# Altium project LAB_B3_209_V1.PrjPcb
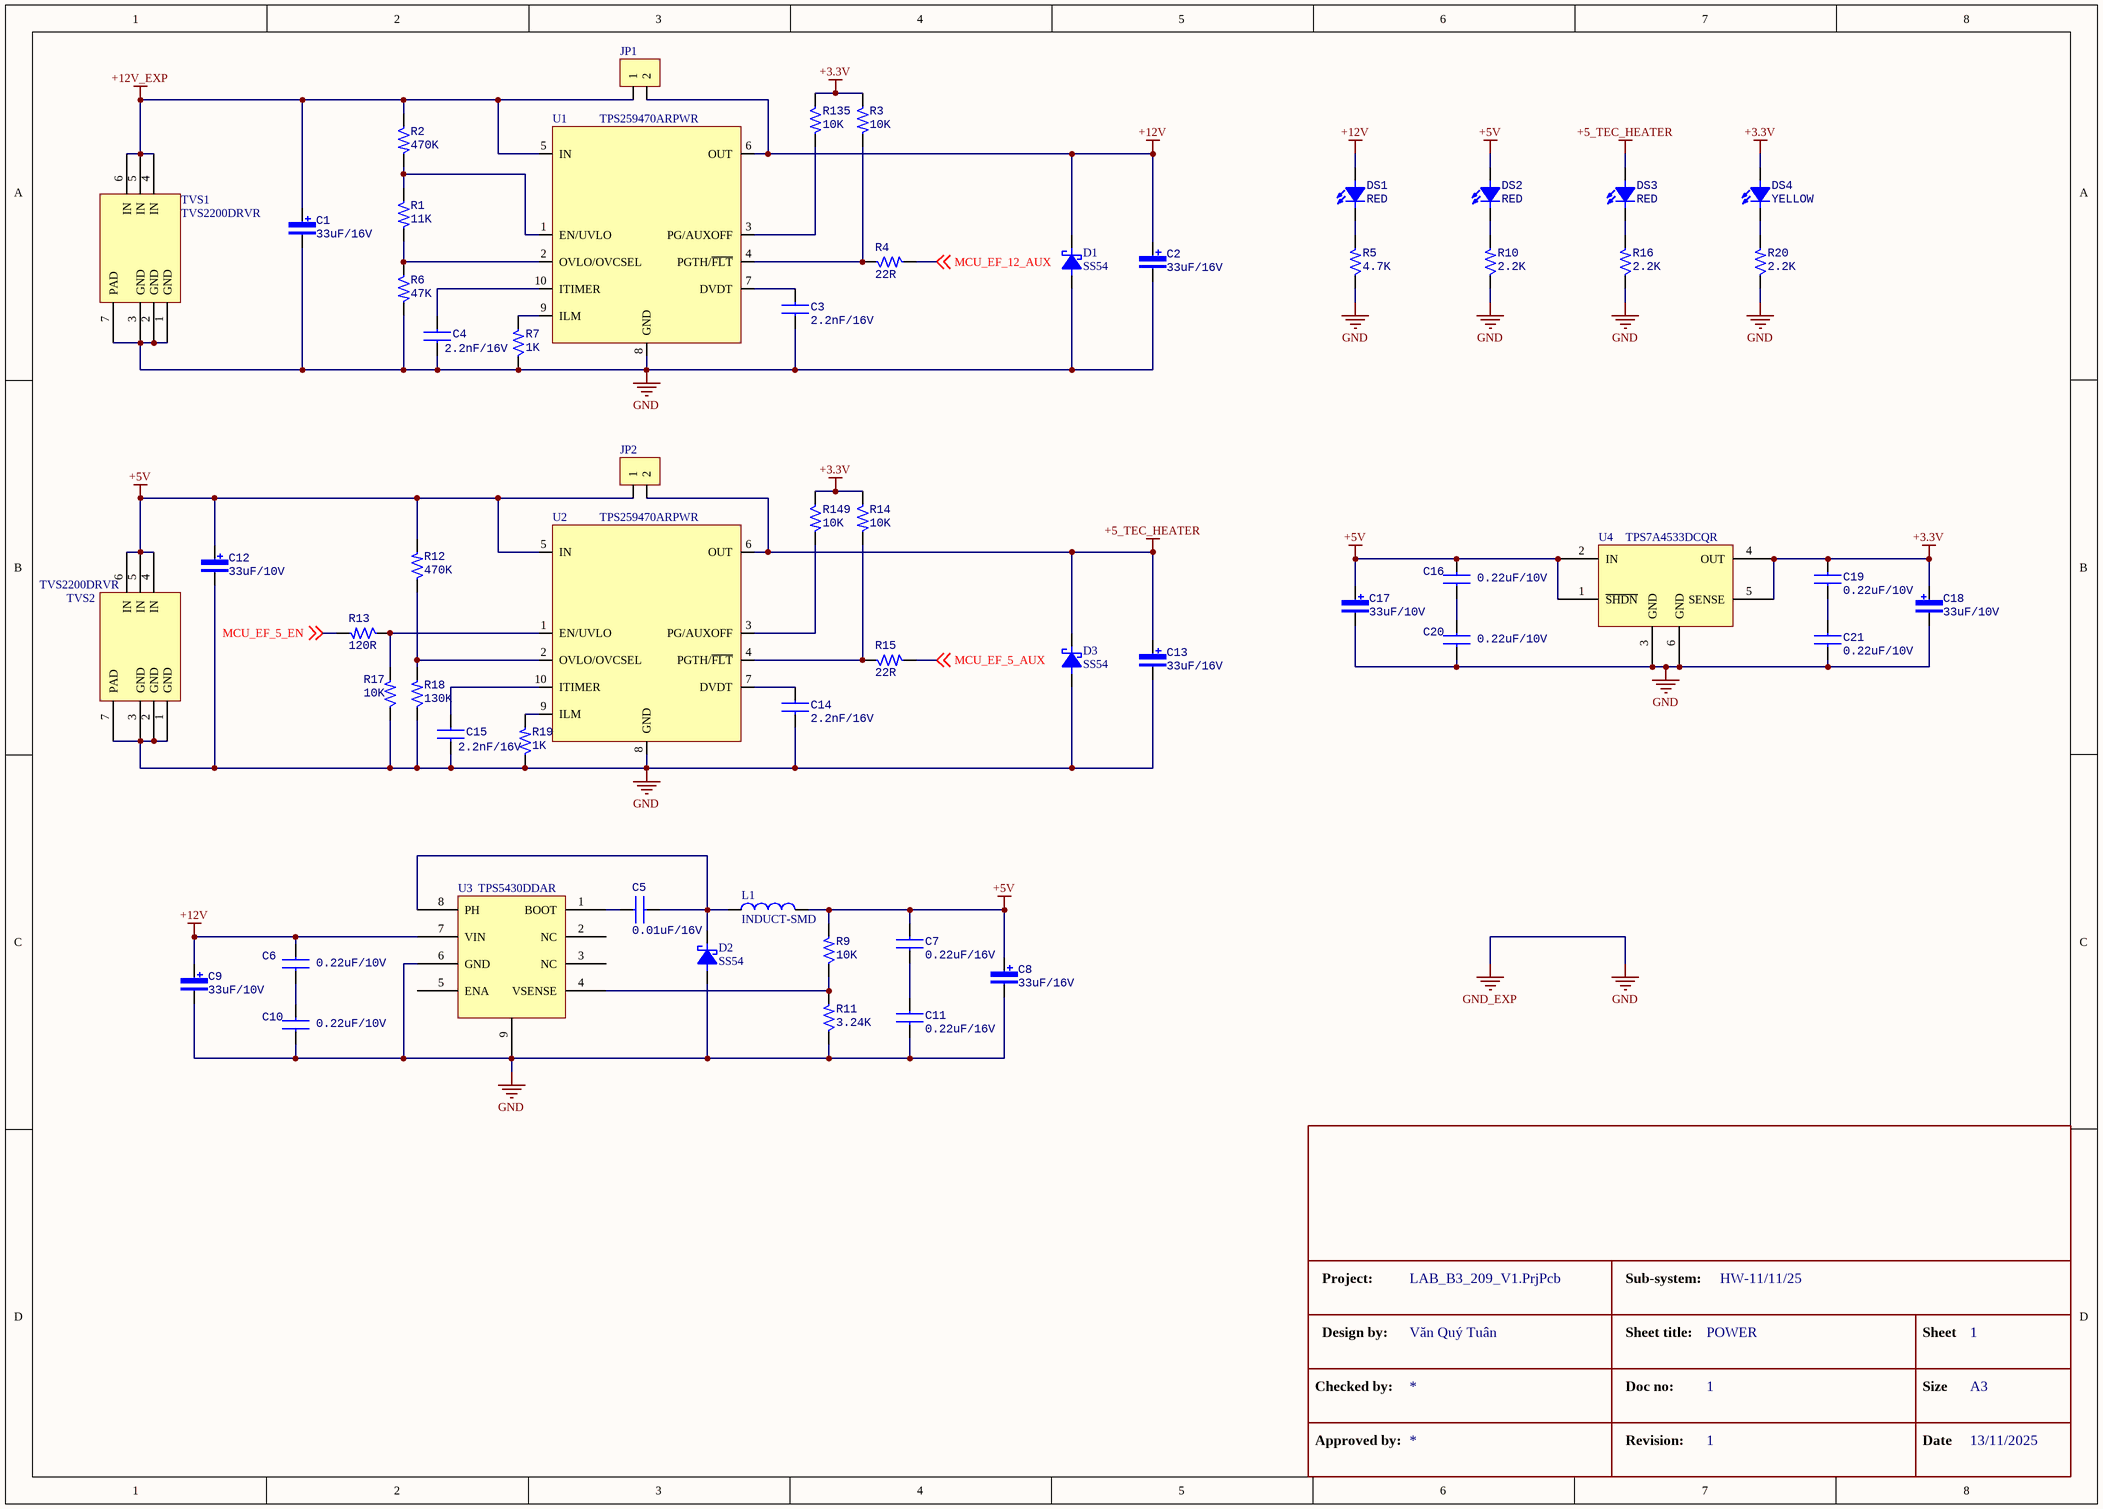
[diagram p0: POWER.SchDoc]
10 sheets, 368 parts. Net scope: global (net labels, ports and power ports of the same name join across sheets).
Board file: LAB_B3_209_V1.PcbDoc
Sheets:
  POWER.SchDoc
  MCU.SchDoc
  FRAM.SchDoc
  IR_LED.SchDoc
  I2C_SENSOR.SchDoc
  NTC.SchDoc
  HEATER.SchDoc
  TEC_DRV.SchDoc
  EXP_OBC_COMM.SchDoc
  HEADER.SchDoc

## Sheet POWER.SchDoc: POWER
size A3; Date: 13/11/2025; DrawnBy: Văn Quý Tuân; Revision: 1; SheetNumber: 1; SheetTotal: 10; Size: A3; Subsystem: HW-11/11/25

### Parts
C1  33uF/16V  [CAP-TAN-2312]
C2  33uF/16V  [CAP-TAN-2312]
C3  2.2nF/16V  [CAP-CER-0603]
C4  2.2nF/16V  [CAP-CER-0603]
C5  0.01uF/16V  [CAP-CER-0603]
C6  0.22uF/10V  [CAP-CER-0603]
C7  0.22uF/16V  [CAP-CER-0603]
C8  33uF/16V  [CAP-TAN-2312]
C9  33uF/10V  [CAP-TAN-2312]
C10  0.22uF/10V  [CAP-CER-0603]
C11  0.22uF/16V  [CAP-CER-0603]
C12  33uF/10V  [CAP-TAN-2312]
C13  33uF/16V  [CAP-TAN-2312]
C14  2.2nF/16V  [CAP-CER-0603]
C15  2.2nF/16V  [CAP-CER-0603]
C16  0.22uF/10V  [CAP-CER-0603]
C17  33uF/10V  [CAP-TAN-2312]
C18  33uF/10V  [CAP-TAN-2312]
C19  0.22uF/10V  [CAP-CER-0603]
C20  0.22uF/10V  [CAP-CER-0603]
C21  0.22uF/10V  [CAP-CER-0603]
D1  SS54  [DIODE SMA]
D2  SS54  [DIODE SMA]
D3  SS54  [DIODE SMA]
DS1  RED  [LED-SMD-0603]
DS2  RED  [LED-SMD-0603]
DS3  RED  [LED-SMD-0603]
DS4  YELLOW  [LED-SMD-0603]
JP1  JP 1x2 2.54  [JP 1x2 DT]  (value not drawn)
JP2  JP 1x2 2.54  [JP 1x2 DT]  (value not drawn)
L1  INDUCT-SMD  [INDUCTOR-FIXED IND 22UH 2.5A 170 MOHM SMD]
R1  11K  [RES-SMD-0603]
R2  470K  [RES-SMD-0603]
R3  10K  [RES-SMD-0603]
R4  22R  [RES-SMD-0603]
R5  4.7K  [RES-SMD-0603]
R6  47K  [RES-SMD-0603]
R7  1K  [RES-SMD-0603]
R9  10K  [RES-SMD-0603]
R10  2.2K  [RES-SMD-0603]
R11  3.24K  [RES-SMD-0603]
R12  470K  [RES-SMD-0603]
R13  120R  [RES-SMD-0603]
R14  10K  [RES-SMD-0603]
R15  22R  [RES-SMD-0603]
R16  2.2K  [RES-SMD-0603]
R17  10K  [RES-SMD-0603]
R18  130K  [RES-SMD-0603]
R19  1K  [RES-SMD-0603]
R20  2.2K  [RES-SMD-0603]
R135  10K  [RES-SMD-0603]
R149  10K  [RES-SMD-0603]
TVS1  TVS2200DRVR  [TVS2200DRVR]
TVS2  TVS2200DRVR  [TVS2200DRVR]
U1  TPS259470ARPWR  [VQFN-HR-10]
U2  TPS259470ARPWR  [VQFN-HR-10]
U3  TPS5430DDAR  [TPS5430DDAR]
U4  TPS7A4533DCQR  [TPS7A4533DCQR]

### Nets
+3.3V: C18.1 C19.2 DS4.A R3.1 R14.1 R135.1 R149.1 U4.4(OUT) U4.5(SENSE)
+5_TEC_HEATER: C13.1 D3.2(K) DS3.A JP2.2 U2.6(OUT)
+5V: C7.1 C8.1 C12.1 C16.2 C17.1 DS2.A JP2.1 L1.2 R9.2 R12.2 TVS2.4(IN) TVS2.5(IN) TVS2.6(IN) U2.5(IN) U4.1(~{SHDN}) U4.2(IN)
+12V: C2.1 C6.2 C9.1 D1.2(K) DS1.A JP1.2 U1.6(OUT) U3.7(VIN)
+12V_EXP: C1.1 JP1.1 R2.1 TVS1.4(IN) TVS1.5(IN) TVS1.6(IN) U1.5(IN)
GND: C1.2 C2.2 C3.1 C4.1 C8.2 C9.2 C10.1 C11.2 C12.2 C13.2 C14.1 C15.1 C17.2 C18.2 C20.1 C21.1 D1.1(A) D2.1(A) D3.1(A) R5.1 R6.2 R7.1 R10.1 R11.1 R16.1 R17.1 R18.1 R19.1 R20.1 TVS1.1(GND) TVS1.2(GND) TVS1.3(GND) TVS1.7(PAD) TVS2.1(GND) TVS2.2(GND) TVS2.3(GND) TVS2.7(PAD) U1.8(GND) U2.8(GND) U3.6(GND) U3.9(PAD) U4.3(GND) U4.6(GND)  [also labelled GND_EXP]
MCU_EF_5_AUX: R15.2 ; off-sheet MCU_EF_5_AUX
MCU_EF_5_EN: R13.2 ; off-sheet MCU_EF_5_EN
MCU_EF_12_AUX: R4.2 ; off-sheet MCU_EF_12_AUX
NetC3_2: C3.2 U1.7(DVDT)
NetC4_2: C4.2 U1.10(ITIMER)
NetC5_1: C5.1 D2.2(K) L1.1 U3.8(PH)
NetC5_2: C5.2 U3.1(BOOT)
NetC6_1: C6.1 C10.2
NetC7_2: C7.2 C11.1
NetC14_2: C14.2 U2.7(DVDT)
NetC15_2: C15.2 U2.10(ITIMER)
NetC16_1: C16.1 C20.2
NetC19_1: C19.1 C21.2
NetDS1_K: DS1.K R5.2
NetDS2_K: DS2.K R10.2
NetDS3_K: DS3.K R16.2
NetDS4_K: DS4.K R20.2
NetR1_1: R1.1 R2.2 U1.1(EN/UVLO)
NetR1_2: R1.2 R6.1 U1.2(OVLO/OVCSEL)
NetR3_2: R3.2 R4.1 U1.4(PGTH/~{FLT})
NetR7_2: R7.2 U1.9(ILM)
NetR9_1: R9.1 R11.2 U3.4(VSENSE)
NetR12_1: R12.1 R18.2 U2.2(OVLO/OVCSEL)
NetR13_1: R13.1 R17.2 U2.1(EN/UVLO)
NetR14_2: R14.2 R15.1 U2.4(PGTH/~{FLT})
NetR19_2: R19.2 U2.9(ILM)
NetR135_2: R135.2 U1.3(PG/AUXOFF)
NetR149_2: R149.2 U2.3(PG/AUXOFF)

Not connected (* = marked no-connect by the designer): U3 2(NC) 3(NC) 5(ENA)

### Notes on the sheet
- Project:
- Sub-system:
- Checked by:
- Design by:
- Sheet title:
- Doc no:
- Sheet
- Size
- Approved by:
- Revision:
- Date
- Text

### Library data of the parts
C1 C2 C8 C9 C12 C13 C17 C18 = CAP-TAN
C3-C7 C10 C11 C14-C16 C19-C21 = CAP-CER
D1-D3 = DIODE-SCHOTTKY
DS1-DS4 = LED
JP1 JP2 = JP 1x2 2.54 Duc Thang: Cắm; Ten_Linh_Kien: Jump Đơn Đực 2.54MM 1x40P Thẳng 11MM; Don_Vi: Con; Ma_Hang: MH000903; Ghi_Chu: *; Kieu_Chan: *; Chung_Loai: Cắm
L1 = INDUCT-SMD: MP: LQM18PZ2R2MFHD; MF: Murata; Price: None; Package: 1608 Murata; Value: *; SnapEDA_Link: https://www.snapeda.com/parts/LQM18PZ2R2MFHD/Murata/view-part/1498702/?ref=snap; Availability: Good; Check_prices: https://www.snapeda.com/parts/LQM18PZ2R2MFHD/Murata/view-part/1498702/?ref=eda; Purchase-URL: https://pricing.snapeda.com/search/part/LQM18PZ2R2MFHD/?ref=eda
R1-R7 R9-R20 R135 R149 = RES-SMD
U1 U2 = TPS259472ARPWR: 2.7-V–23-V, 5.5-A, 28-mΩ True Reverse Current Blocking eFuse with / Input Reverse Polarity Protection; Manufacturer: Texas Instruments; Manufacturer Part Number: TPS259472ARPWR

## Sheet MCU.SchDoc: MCU
size A3; Date: 13/11/2025; DrawnBy: Văn Quý Tuân; Revision: 1; SheetNumber: 2; SheetTotal: 10; Size: A3; Subsystem: HW-11/11/25
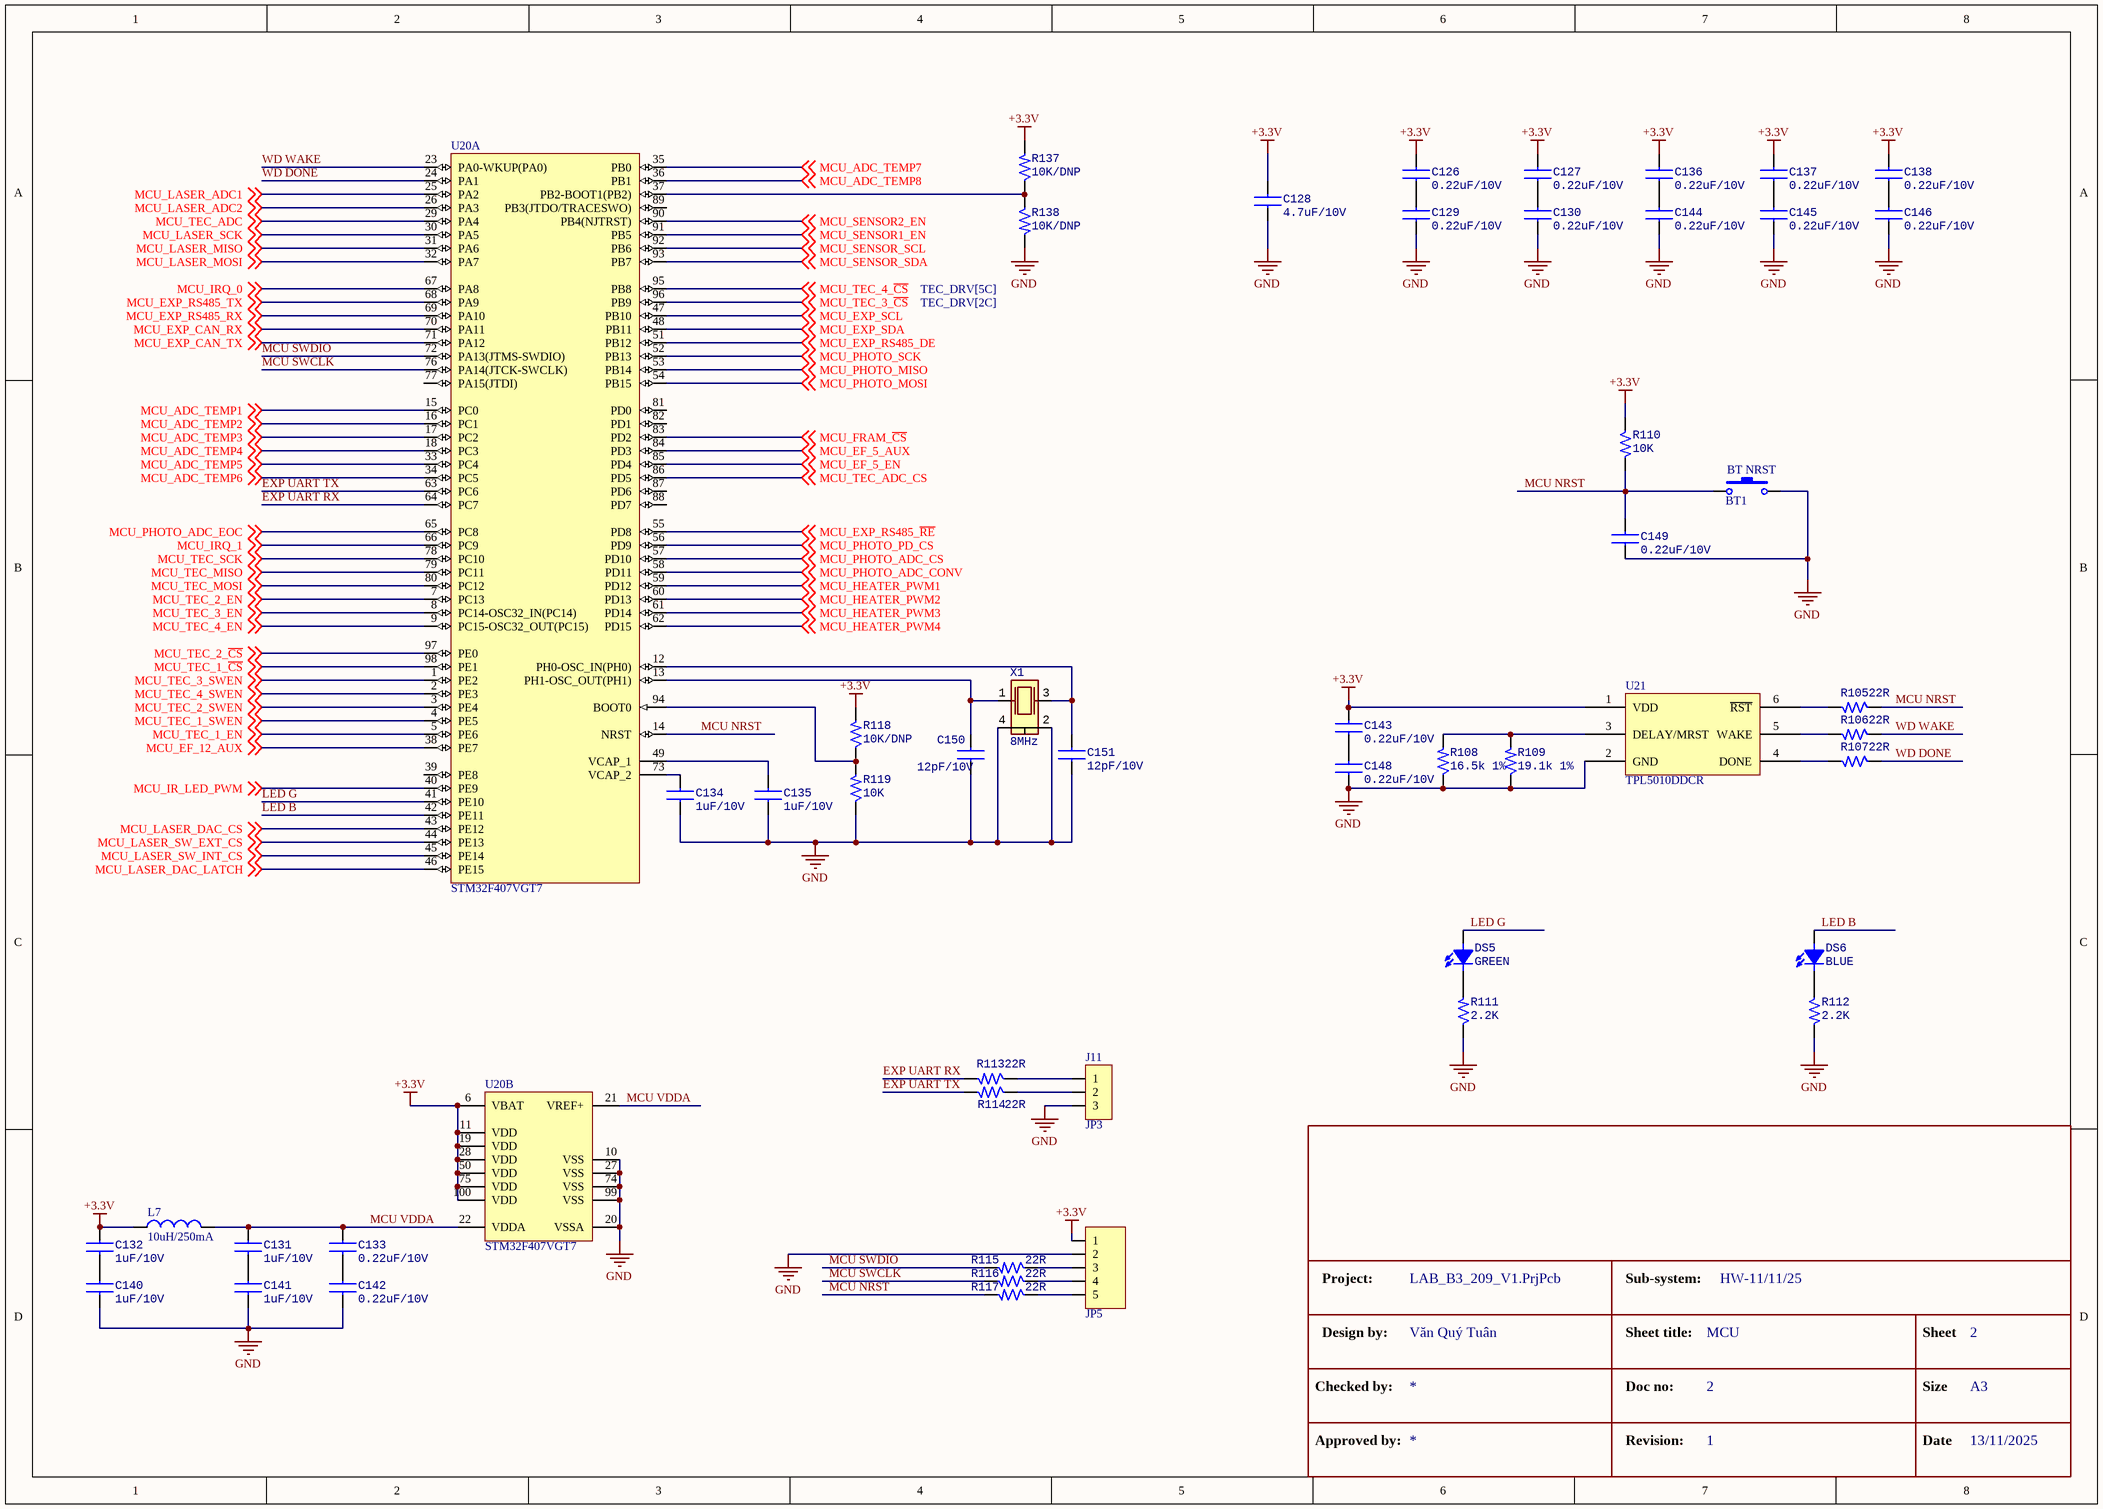
[diagram p1: MCU.SchDoc]

### Parts
BT1  BT NRST  [SW-SMD]
C126  0.22uF/10V  [CAP-CER-0603]
C127  0.22uF/10V  [CAP-CER-0603]
C128  4.7uF/10V  [CAP-CER-0603]
C129  0.22uF/10V  [CAP-CER-0603]
C130  0.22uF/10V  [CAP-CER-0603]
C131  1uF/10V  [CAP-CER-0603]
C132  1uF/10V  [CAP-CER-0603]
C133  0.22uF/10V  [CAP-CER-0603]
C134  1uF/10V  [CAP-CER-0603]
C135  1uF/10V  [CAP-CER-0603]
C136  0.22uF/10V  [CAP-CER-0603]
C137  0.22uF/10V  [CAP-CER-0603]
C138  0.22uF/10V  [CAP-CER-0603]
C140  1uF/10V  [CAP-CER-0603]
C141  1uF/10V  [CAP-CER-0603]
C142  0.22uF/10V  [CAP-CER-0603]
C143  0.22uF/10V  [CAP-CER-0603]
C144  0.22uF/10V  [CAP-CER-0603]
C145  0.22uF/10V  [CAP-CER-0603]
C146  0.22uF/10V  [CAP-CER-0603]
C148  0.22uF/10V  [CAP-CER-0603]
C149  0.22uF/10V  [CAP-CER-0603]
C150  12pF/10V  [CAP-CER-0603]
C151  12pF/10V  [CAP-CER-0603]
DS5  GREEN  [LED-SMD-0603]
DS6  BLUE  [LED-SMD-0603]
J6  JP5  [JP 1x5 CT]
J11  JP3  [JP 1x3 CT]
L7  10uH/250mA  [INDUCT-SMD-0603]
R105  22R  [RES-SMD-0603]
R106  22R  [RES-SMD-0603]
R107  22R  [RES-SMD-0603]
R108  16.5k 1%  [RES-SMD-0603]
R109  19.1k 1%  [RES-SMD-0603]
R110  10K  [RES-SMD-0603]
R111  2.2K  [RES-SMD-0603]
R112  2.2K  [RES-SMD-0603]
R113  22R  [RES-SMD-0603]
R114  22R  [RES-SMD-0603]
R115  22R  [RES-SMD-0603]
R116  22R  [RES-SMD-0603]
R117  22R  [RES-SMD-0603]
R118  10K/DNP  [RES-SMD-0603]
R119  10K  [RES-SMD-0603]
R137  10K/DNP  [RES-SMD-0603]
R138  10K/DNP  [RES-SMD-0603]
U20  STM32F407VGT7  [STM-LQFP100_V]  (parts A,B of 2)
U21  TPL5010DDCR  [TPL5010DDCR]
X1  8MHz  [CRYSTAL-4POS-3.2x2.5]

### Nets
+3.3V: C126.1 C127.1 C128.1 C132.1 C136.1 C137.1 C138.1 C143.1 J6.1 L7.1 R110.1 R118.2 R137.2 U20.6(VBAT) U20.11(VDD) U20.19(VDD) U20.28(VDD) U20.50(VDD) U20.75(VDD) U20.100(VDD) U21.1(VDD)
GND: BT1.2 C128.2 C129.2 C130.2 C134.2 C135.2 C140.2 C141.2 C142.2 C144.2 C145.2 C146.2 C148.2 C149.2 C150.2 C151.2 J6.2 J11.3 R108.1 R109.1 R111.1 R112.2 R119.1 R138.2 U20.10(VSS) U20.20(VSSA) U20.27(VSS) U20.74(VSS) U20.99(VSS) U21.2(GND) X1.2 X1.4
EXP UART RX: R113.2 U20.64(PC7)
EXP UART TX: R114.2 U20.63(PC6)
LED B: DS6.A U20.42(PE11)
LED G: DS5.A U20.41(PE10)
MCU NRST: BT1.1 C149.1 R105.1 R110.2 R117.2 U20.14(NRST)
MCU SWCLK: R116.2 U20.76(PA14(JTCK-SWCLK))
MCU SWDIO: R115.2 U20.72(PA13(JTMS-SWDIO))
MCU VDDA: C131.1 C133.1 L7.2 U20.21(VREF+) U20.22(VDDA)
MCU_ADC_TEMP1: U20.15(PC0) ; off-sheet MCU_ADC_TEMP1
MCU_ADC_TEMP2: U20.16(PC1) ; off-sheet MCU_ADC_TEMP2
MCU_ADC_TEMP3: U20.17(PC2) ; off-sheet MCU_ADC_TEMP3
MCU_ADC_TEMP4: U20.18(PC3) ; off-sheet MCU_ADC_TEMP4
MCU_ADC_TEMP5: U20.33(PC4) ; off-sheet MCU_ADC_TEMP5
MCU_ADC_TEMP6: U20.34(PC5) ; off-sheet MCU_ADC_TEMP6
MCU_ADC_TEMP7: U20.35(PB0) ; off-sheet MCU_ADC_TEMP7
MCU_ADC_TEMP8: U20.36(PB1) ; off-sheet MCU_ADC_TEMP8
MCU_EF_5_AUX: U20.84(PD3) ; off-sheet MCU_EF_5_AUX
MCU_EF_5_EN: U20.85(PD4) ; off-sheet MCU_EF_5_EN
MCU_EF_12_AUX: U20.38(PE7) ; off-sheet MCU_EF_12_AUX
MCU_EXP_CAN_RX: U20.70(PA11) ; off-sheet MCU_EXP_CAN_RX
MCU_EXP_CAN_TX: U20.71(PA12) ; off-sheet MCU_EXP_CAN_TX
MCU_EXP_RS485_DE: U20.51(PB12) ; off-sheet MCU_EXP_RS485_DE
MCU_EXP_RS485_~{RE}: U20.55(PD8) ; off-sheet MCU_EXP_RS485_~{RE}
MCU_EXP_RS485_RX: U20.69(PA10) ; off-sheet MCU_EXP_RS485_RX
MCU_EXP_RS485_TX: U20.68(PA9) ; off-sheet MCU_EXP_RS485_TX
MCU_EXP_SCL: U20.47(PB10) ; off-sheet MCU_EXP_SCL
MCU_EXP_SDA: U20.48(PB11) ; off-sheet MCU_EXP_SDA
MCU_FRAM_~{CS}: U20.83(PD2) ; off-sheet MCU_FRAM_~{CS}
MCU_HEATER_PWM1: U20.59(PD12) ; off-sheet MCU_HEATER_PWM1
MCU_HEATER_PWM2: U20.60(PD13) ; off-sheet MCU_HEATER_PWM2
MCU_HEATER_PWM3: U20.61(PD14) ; off-sheet MCU_HEATER_PWM3
MCU_HEATER_PWM4: U20.62(PD15) ; off-sheet MCU_HEATER_PWM4
MCU_IR_LED_PWM: U20.40(PE9) ; off-sheet MCU_IR_LED_PWM
MCU_IRQ_0: U20.67(PA8) ; off-sheet MCU_IRQ_0
MCU_IRQ_1: U20.66(PC9) ; off-sheet MCU_IRQ_1
MCU_LASER_ADC1: U20.25(PA2) ; off-sheet MCU_LASER_ADC1
MCU_LASER_ADC2: U20.26(PA3) ; off-sheet MCU_LASER_ADC2
MCU_LASER_DAC_CS: U20.43(PE12) ; off-sheet MCU_LASER_DAC_CS
MCU_LASER_DAC_LATCH: U20.46(PE15) ; off-sheet MCU_LASER_DAC_LATCH
MCU_LASER_MISO: U20.31(PA6) ; off-sheet MCU_LASER_MISO
MCU_LASER_MOSI: U20.32(PA7) ; off-sheet MCU_LASER_MOSI
MCU_LASER_SCK: U20.30(PA5) ; off-sheet MCU_LASER_SCK
MCU_LASER_SW_EXT_CS: U20.44(PE13) ; off-sheet MCU_LASER_SW_EXT_CS
MCU_LASER_SW_INT_CS: U20.45(PE14) ; off-sheet MCU_LASER_SW_INT_CS
MCU_PHOTO_ADC_CONV: U20.58(PD11) ; off-sheet MCU_PHOTO_ADC_CONV
MCU_PHOTO_ADC_CS: U20.57(PD10) ; off-sheet MCU_PHOTO_ADC_CS
MCU_PHOTO_ADC_EOC: U20.65(PC8) ; off-sheet MCU_PHOTO_ADC_EOC
MCU_PHOTO_MISO: U20.53(PB14) ; off-sheet MCU_PHOTO_MISO
MCU_PHOTO_MOSI: U20.54(PB15) ; off-sheet MCU_PHOTO_MOSI
MCU_PHOTO_PD_CS: U20.56(PD9) ; off-sheet MCU_PHOTO_PD_CS
MCU_PHOTO_SCK: U20.52(PB13) ; off-sheet MCU_PHOTO_SCK
MCU_SENSOR1_EN: U20.91(PB5) ; off-sheet MCU_SENSOR1_EN
MCU_SENSOR2_EN: U20.90(PB4(NJTRST)) ; off-sheet MCU_SENSOR2_EN
MCU_SENSOR_SCL: U20.92(PB6) ; off-sheet MCU_SENSOR_SCL
MCU_SENSOR_SDA: U20.93(PB7) ; off-sheet MCU_SENSOR_SDA
MCU_TEC_1_~{CS}: U20.98(PE1) ; off-sheet MCU_TEC_1_~{CS}
MCU_TEC_1_EN: U20.5(PE6) ; off-sheet MCU_TEC_1_EN
MCU_TEC_1_SWEN: U20.4(PE5) ; off-sheet MCU_TEC_1_SWEN
MCU_TEC_2_~{CS}: U20.97(PE0) ; off-sheet MCU_TEC_2_~{CS}
MCU_TEC_2_EN: U20.7(PC13) ; off-sheet MCU_TEC_2_EN
MCU_TEC_2_SWEN: U20.3(PE4) ; off-sheet MCU_TEC_2_SWEN
MCU_TEC_3_~{CS}: U20.96(PB9) ; off-sheet MCU_TEC_3_~{CS}
MCU_TEC_3_EN: U20.8(PC14-OSC32_IN(PC14)) ; off-sheet MCU_TEC_3_EN
MCU_TEC_3_SWEN: U20.1(PE2) ; off-sheet MCU_TEC_3_SWEN
MCU_TEC_4_~{CS}: U20.95(PB8) ; off-sheet MCU_TEC_4_~{CS}
MCU_TEC_4_EN: U20.9(PC15-OSC32_OUT(PC15)) ; off-sheet MCU_TEC_4_EN
MCU_TEC_4_SWEN: U20.2(PE3) ; off-sheet MCU_TEC_4_SWEN
MCU_TEC_ADC: U20.29(PA4) ; off-sheet MCU_TEC_ADC
MCU_TEC_ADC_CS: U20.86(PD5) ; off-sheet MCU_TEC_ADC_CS
MCU_TEC_MISO: U20.79(PC11) ; off-sheet MCU_TEC_MISO
MCU_TEC_MOSI: U20.80(PC12) ; off-sheet MCU_TEC_MOSI
MCU_TEC_SCK: U20.78(PC10) ; off-sheet MCU_TEC_SCK
WD DONE: R107.1 U20.24(PA1)
WD WAKE: R106.1 U20.23(PA0-WKUP(PA0))
NetC126_2: C126.2 C129.1
NetC127_2: C127.2 C130.1
NetC131_2: C131.2 C141.1
NetC132_2: C132.2 C140.1
NetC133_2: C133.2 C142.1
NetC134_1: C134.1 U20.73(VCAP_2)
NetC135_1: C135.1 U20.49(VCAP_1)
NetC136_2: C136.2 C144.1
NetC137_2: C137.2 C145.1
NetC138_2: C138.2 C146.1
NetC143_2: C143.2 C148.1
NetC150_1: C150.1 U20.13(PH1-OSC_OUT(PH1)) X1.1
NetC151_1: C151.1 U20.12(PH0-OSC_IN(PH0)) X1.3
NetDS5_K: DS5.K R111.2
NetDS6_K: DS6.K R112.1
NetJ6_3: J6.3 R115.1
NetJ6_4: J6.4 R116.1
NetJ6_5: J6.5 R117.1
NetJ11_1: J11.1 R113.1
NetJ11_2: J11.2 R114.1
NetR105_2: R105.2 U21.6(~{RST})
NetR106_2: R106.2 U21.5(WAKE)
NetR107_2: R107.2 U21.4(DONE)
NetR108_2: R108.2 R109.2 U21.3(DELAY/MRST)
NetR118_1: R118.1 R119.2 U20.94(BOOT0)
NetR137_1: R137.1 R138.1 U20.37(PB2-BOOT1(PB2))

Not connected (* = marked no-connect by the designer): U20 39(PE8) 77(PA15(JTDI)) 81(PD0) 82(PD1) 87(PD6) 88(PD7) 89(PB3(JTDO/TRACESWO))

### Notes on the sheet
- Project:
- Sub-system:
- Checked by:
- Design by:
- Sheet title:
- Doc no:
- Sheet
- Size
- Approved by:
- Revision:
- Date
- Text

### Library data of the parts
BT1 = SW-SMD: Switch; Published: 24-Mar-1999; LatestRevisionDate: 17-Jul-2002; LatestRevisionNote: Re-released for DXP Platform.; PackageReference: SPST-2; Publisher: Altium Limited
C126-C138 C140-C146 C148-C151 = CAP-CER
DS5 DS6 = LED
J6 = JP 1x5 2.54 Cai Thang: 1X5 2.54; Ten_Linh_Kien: Jump Đơn Cái 2.54MM 1x20P Thẳng; Don_Vi: Con; Ma_Hang: MH004006; Chung_Loai: Cắm; Ghi_Chu: *; Kieu_Chan: *
J11 = JP 1x3 2.54 Cai Thang: 1X3 2.54; Ten_Linh_Kien: Jump Đơn Cái 2.54MM 1x20P Thẳng; Don_Vi: Con; Ma_Hang: MH004006; Chung_Loai: Cắm; Ghi_Chu: *; Kieu_Chan: *
L7 = INDUCT-SMD: MP: LQM18PZ2R2MFHD; MF: Murata; Price: None; Package: 1608 Murata; Value: *; SnapEDA_Link: https://www.snapeda.com/parts/LQM18PZ2R2MFHD/Murata/view-part/1498702/?ref=snap; Availability: Good; Check_prices: https://www.snapeda.com/parts/LQM18PZ2R2MFHD/Murata/view-part/1498702/?ref=eda; Purchase-URL: https://pricing.snapeda.com/search/part/LQM18PZ2R2MFHD/?ref=eda
R105-R119 R137 R138 = RES-SMD
U20 = STM32F407VGT7: ARM Cortex-M4 32-bit MCU+FPU, 210 DMIPS, 1024 kB Flash, 192 kB Internal RAM, 82 I/Os, 100-pin LQFP, -40 to 105 degC, Tray; Manufacturer: STMicroelectronics; D/A Converter: 2x12-bit; FLASH Size (Prog) (kB): 1024; I/Os (High Current): 82; Internal RAM Size (kB): 192; Operating Frequency(F) (Processor speed) (MHz): 168; Supply Voltage(Vcc) max (V): 3.6; Supply Voltage(Vcc) min (V): 1.8; DatasheetVersion: Rev. 4; PackageVersion: Rev. 1, 06/2013; PackageReference: LQFP100; PackageDescription: 100-Pin Low Profile Quad Flat Package, 14 x 14 mm Body, 0.5 mm Pitch; Supplier 1: Digi-Key; Supplier Part Number 1: STM32F407VGT7-ND; Supplier 2: Farnell; Supplier Part Number 2: 2333298; Supplier 3: Newark; Supplier Part Number 3: 99W9914; Supplier 4: Newark; Supplier Part Number 4: 48W6905; Supplier 5: Mouser; Supplier Part Number 5: 511-STM32F407VGT7; Core: ARM Cortex-M4; Packing: Tray; Mounting Technology: Surface Mount; PartNumber: STM32F407VGT7; ComponentLink1Description: Manufacturer URL; ComponentLink1URL: http://www.st.com/web/en/home.html; ComponentLink2Description: Datasheet; ComponentLink2URL: http://www.st.com/st-web-ui/static/active/en/resource/technical/document/datasheet/DM00037051.pdf; ComponentLink3Description: Package Specification; ComponentLink3URL: http://www.st.com/st-web-ui/static/active/en/resource/technical/document/data_brief/DM00071938.pdf
X1 = CRYSTAL-4POS: Crystal, 8 MHz, -30 to 85 degC, 3.2 x 2.5 x 0.9 mm SMD

## Sheet FRAM.SchDoc: FRAM
size A3; Date: 13/11/2025; DrawnBy: Văn Quý Tuân; DocumentNumber: 1; Revision: 1; SheetNumber: 3; SheetTotal: 10; Subsystem: HW-11/11/25; Size: A3
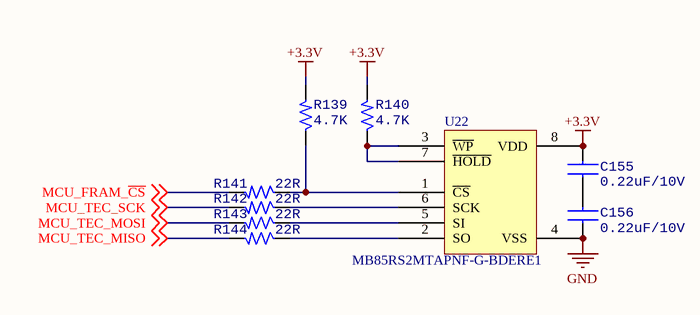
[diagram p2: FRAM.SchDoc]

### Parts
C155  0.22uF/10V  [CAP-CER-0603]
C156  0.22uF/10V  [CAP-CER-0603]
R139  4.7K  [RES-SMD-0603]
R140  4.7K  [RES-SMD-0603]
R141  22R  [RES-SMD-0603]
R142  22R  [RES-SMD-0603]
R143  22R  [RES-SMD-0603]
R144  22R  [RES-SMD-0603]
U22  MB85RS2MTAPNF-G-BDERE1  [MB85RS2MTAPNF-G-BDERE1]

### Nets
+3.3V: C155.1 R139.2 R140.2 U22.8(VDD)
GND: C156.2 U22.4(VSS)
MCU_FRAM_~{CS}: R141.2 ; off-sheet MCU_FRAM_~{CS}
MCU_TEC_MISO: R144.2 ; off-sheet MCU_TEC_MISO
MCU_TEC_MOSI: R143.2 ; off-sheet MCU_TEC_MOSI
MCU_TEC_SCK: R142.2 ; off-sheet MCU_TEC_SCK
NetC155_2: C155.2 C156.1
NetR139_1: R139.1 R141.1 U22.1(~{CS})
NetR140_1: R140.1 U22.3(~{WP}) U22.7(~{HOLD})
NetR142_1: R142.1 U22.6(SCK)
NetR143_1: R143.1 U22.5(SI)
NetR144_1: R144.1 U22.2(SO)

### Notes on the sheet
- Project:
- Sub-system:
- Checked by:
- Design by:
- Sheet title:
- Doc no:
- Sheet
- Size
- Approved by:
- Revision:
- Date
- Text

### Library data of the parts
C155 C156 = CAP-CER
R139-R144 = RES-SMD

## Sheet IR_LED.SchDoc: IR_LED
size A3; Date: 13/11/2025; DrawnBy: Văn Quý Tuân; Revision: 1; SheetNumber: 4; SheetTotal: 10; Size: A3; Subsystem: HW-11/11/25
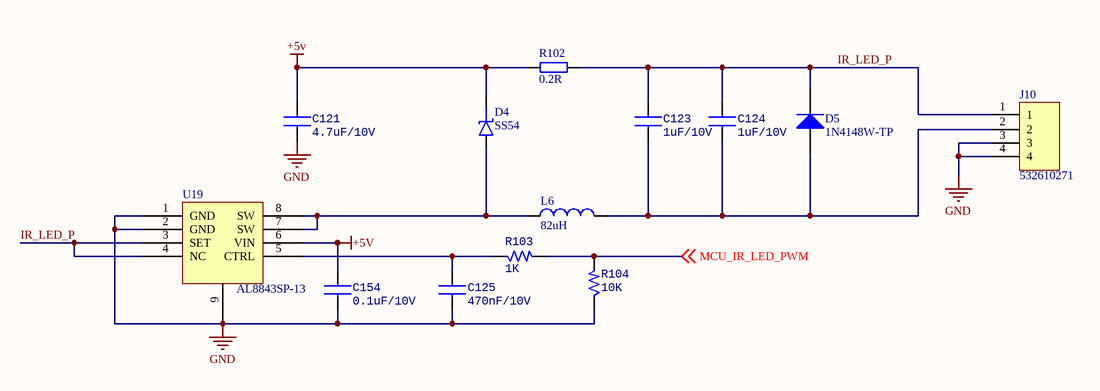
[diagram p3: IR_LED.SchDoc]

### Parts
C121  4.7uF/10V  [CAP-CER-0603]
C123  1uF/10V  [CAP-CER-0603]
C124  1uF/10V  [CAP-CER-0603]
C125  470nF/10V  [CAP-CER-0603]
C154  0.1uF/10V  [CAP-CER-0603]
D4  SS54  [DO-214AC-2 (SMA)]
D5  1N4148W-TP  [DIODE SOD-123]
J10  532610271  [CON4_653104131822_SMD]
L6  82uH  [INDUCTOR-SRR4828A-820M]
R102  0.2R  [RES_1206]
R103  1K  [RES-SMD-0603]
R104  10K  [RES-SMD-0603]
U19  AL8843SP-13  [AL8843SP-13]

### Nets
+5V: C121.1 C154.1 D4.K R102.1 U19.6(VIN)
GND: C121.2 C125.2 C154.2 J10.3 J10.4 R104.1 U19.1(GND) U19.2(GND) U19.9(EPAD)
IR_LED_P: C123.1 C124.1 D5.2(K) J10.1 R102.2 U19.3(SET) U19.4(NC)
MCU_IR_LED_PWM: R103.2 R104.2 ; off-sheet MCU_IR_LED_PWM
NetC123_2: C123.2 C124.2 D5.1(A) J10.2 L6.2
NetC125_1: C125.1 R103.1 U19.5(CTRL)
NetD4_A: D4.A L6.1 U19.7(SW) U19.8(SW)

### Notes on the sheet
- Project:
- Sub-system:
- Checked by:
- Design by:
- Sheet title:
- Doc no:
- Sheet
- Size
- Approved by:
- Revision:
- Date
- Text

### Library data of the parts
C121 C123-C125 C154 = CAP-CER
D4 = D_SCHOTTKY_SMA: Diode Schottky SMD SMA (DO-214AA)
D5 = Diode S4: Dán; Ten_Linh_Kien: Diode S4 SOD123 ( 1N5819 SOD123); Ma_Hang: MH005519; Don_Vi: Con; Ghi_Chu: *; Chung_Loai: Dán; Kieu_Chan: *
J10 = CON-PLG_4X1-50-RA-SMD: 4 Pins, 1 Row 1.25mm Pitch, right angle Connector, male; Manufacturer: WE; Manufacturer Part Number: 653104131822; Mating Part Number: 653004113322; Crimp Part Number: 65300113722DEC; Alternate Part Number-1: NA; Case/Package: TH-CON; Supplier-1: WURTH; Supplier Part Number-1: 653104131822
L6 = INDUCT-SMD: MP: LQM18PZ2R2MFHD; MF: Murata; Price: None; Package: 1608 Murata; Value: *; SnapEDA_Link: https://www.snapeda.com/parts/LQM18PZ2R2MFHD/Murata/view-part/1498702/?ref=snap; Availability: Good; Check_prices: https://www.snapeda.com/parts/LQM18PZ2R2MFHD/Murata/view-part/1498702/?ref=eda; Purchase-URL: https://pricing.snapeda.com/search/part/LQM18PZ2R2MFHD/?ref=eda
R102 = RES_1206: Resistor SMD 1206; Manufacturer: *; Manufacturer Part Number: *; Distributor Link: *; LCSC: *
R103 R104 = RES-SMD

## Sheet I2C_SENSOR.SchDoc: I2C_SENSOR
size A3; Date: 13/11/2025; DrawnBy: Văn Quý Tuân; SheetNumber: 5; SheetTotal: 10; Subsystem: HW-11/11/25; Size: A3
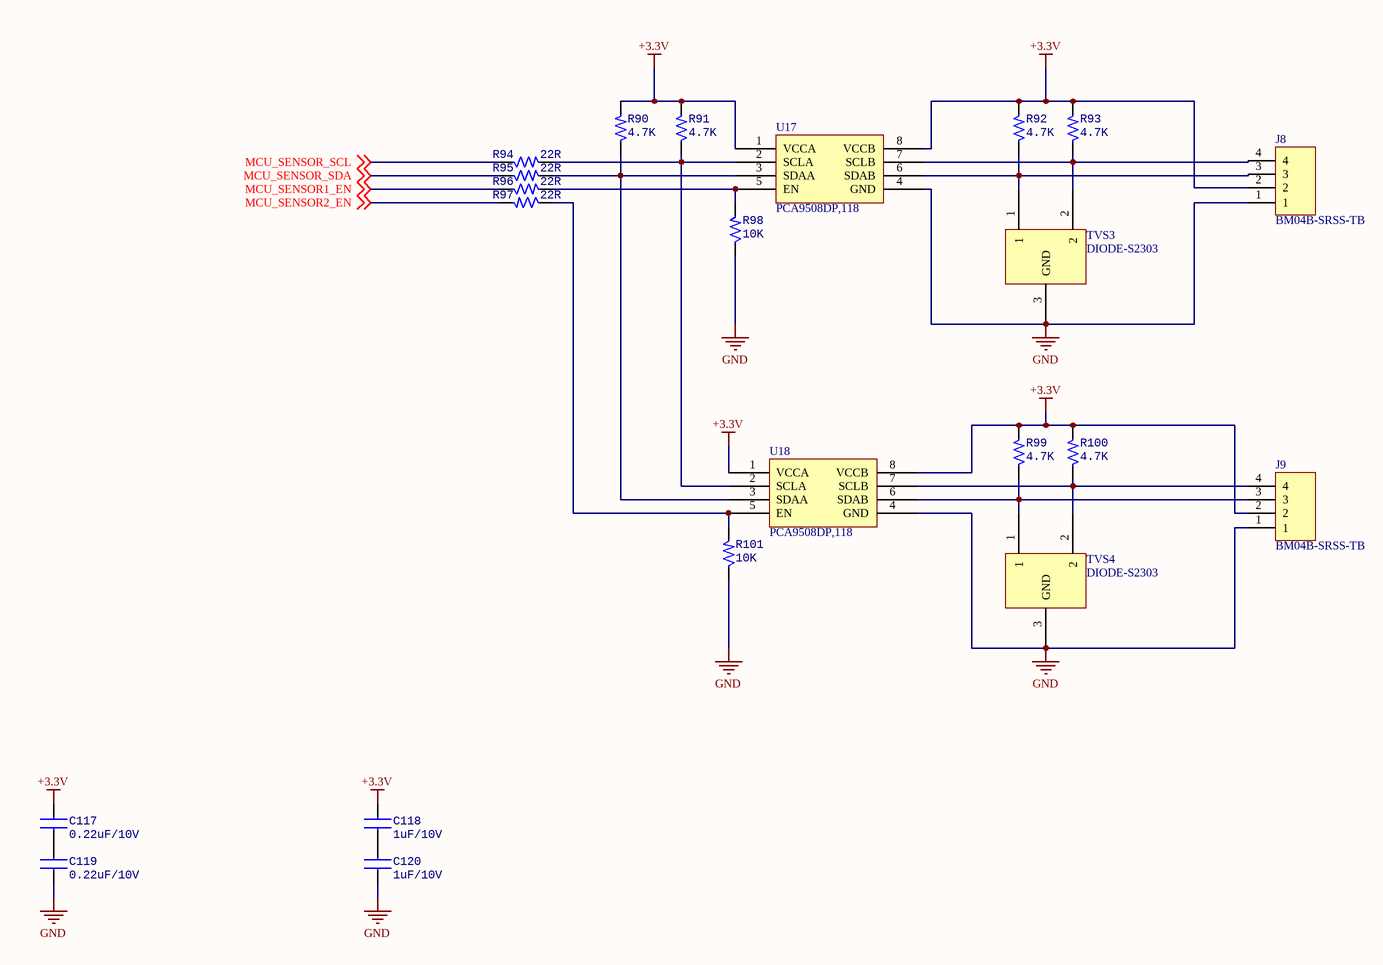
[diagram p4: I2C_SENSOR.SchDoc]

### Parts
C117  0.22uF/10V  [CAP-CER-0603]
C118  1uF/10V  [CAP-CER-0603]
C119  0.22uF/10V  [CAP-CER-0603]
C120  1uF/10V  [CAP-CER-0603]
J8  BM04B-SRSS-TB  [BM04B-SRSS-TB]
J9  BM04B-SRSS-TB  [BM04B-SRSS-TB]
R90  4.7K  [RES-SMD-0603]
R91  4.7K  [RES-SMD-0603]
R92  4.7K  [RES-SMD-0603]
R93  4.7K  [RES-SMD-0603]
R94  22R  [RES-SMD-0603]
R95  22R  [RES-SMD-0603]
R96  22R  [RES-SMD-0603]
R97  22R  [RES-SMD-0603]
R98  10K  [RES-SMD-0603]
R99  4.7K  [RES-SMD-0603]
R100  4.7K  [RES-SMD-0603]
R101  10K  [RES-SMD-0603]
TVS3  DIODE-S2303  [DIODE SOT23]
TVS4  DIODE-S2303  [DIODE SOT23]
U17  PCA9508DP,118  [PCA9508DP,118]
U18  PCA9508DP,118  [PCA9508DP,118]

### Nets
+3.3V: C117.1 C118.1 J8.2 J9.2 R90.2 R91.2 R92.2 R93.2 R99.2 R100.2 U17.1(VCCA) U17.8(VCCB) U18.1(VCCA) U18.8(VCCB)
GND: C119.2 C120.2 J8.1 J9.1 R98.1 R101.1 TVS3.3(GND) TVS4.3(GND) U17.4(GND) U18.4(GND)
MCU_SENSOR1_EN: R96.1 ; off-sheet MCU_SENSOR1_EN
MCU_SENSOR2_EN: R97.2 ; off-sheet MCU_SENSOR2_EN
MCU_SENSOR_SCL: R94.1 ; off-sheet MCU_SENSOR_SCL
MCU_SENSOR_SDA: R95.1 ; off-sheet MCU_SENSOR_SDA
NetC117_2: C117.2 C119.1
NetC118_2: C118.2 C120.1
NetJ8_3: J8.3 R92.1 TVS3.1 U17.6(SDAB)
NetJ8_4: J8.4 R93.1 TVS3.2 U17.7(SCLB)
NetJ9_3: J9.3 R99.1 TVS4.1 U18.6(SDAB)
NetJ9_4: J9.4 R100.1 TVS4.2 U18.7(SCLB)
NetR90_1: R90.1 R95.2 U17.3(SDAA) U18.3(SDAA)
NetR91_1: R91.1 R94.2 U17.2(SCLA) U18.2(SCLA)
NetR96_2: R96.2 R98.2 U17.5(EN)
NetR97_1: R97.1 R101.2 U18.5(EN)

### Notes on the sheet
- Project:
- Sub-system:
- Checked by:
- Design by:
- Sheet title:
- Doc no:
- Sheet
- Size
- Approved by:
- Revision:
- Date
- Text

### Library data of the parts
C117-C120 = CAP-CER
J8 J9 = CON-PLG_4X1-50-RA-SMD: as J10 on sheet IR_LED; Case/Package: TH-CON; Supplier-1: WURTH; Supplier Part Number-1: 653104131822
R90-R101 = RES-SMD

## Sheet NTC.SchDoc: NTC
size A3; Date: 13/11/2025; DrawnBy: Văn Quý Tuân; Revision: 1; SheetNumber: 6; SheetTotal: 10; Subsystem: HW-11/11/25; Size: A3
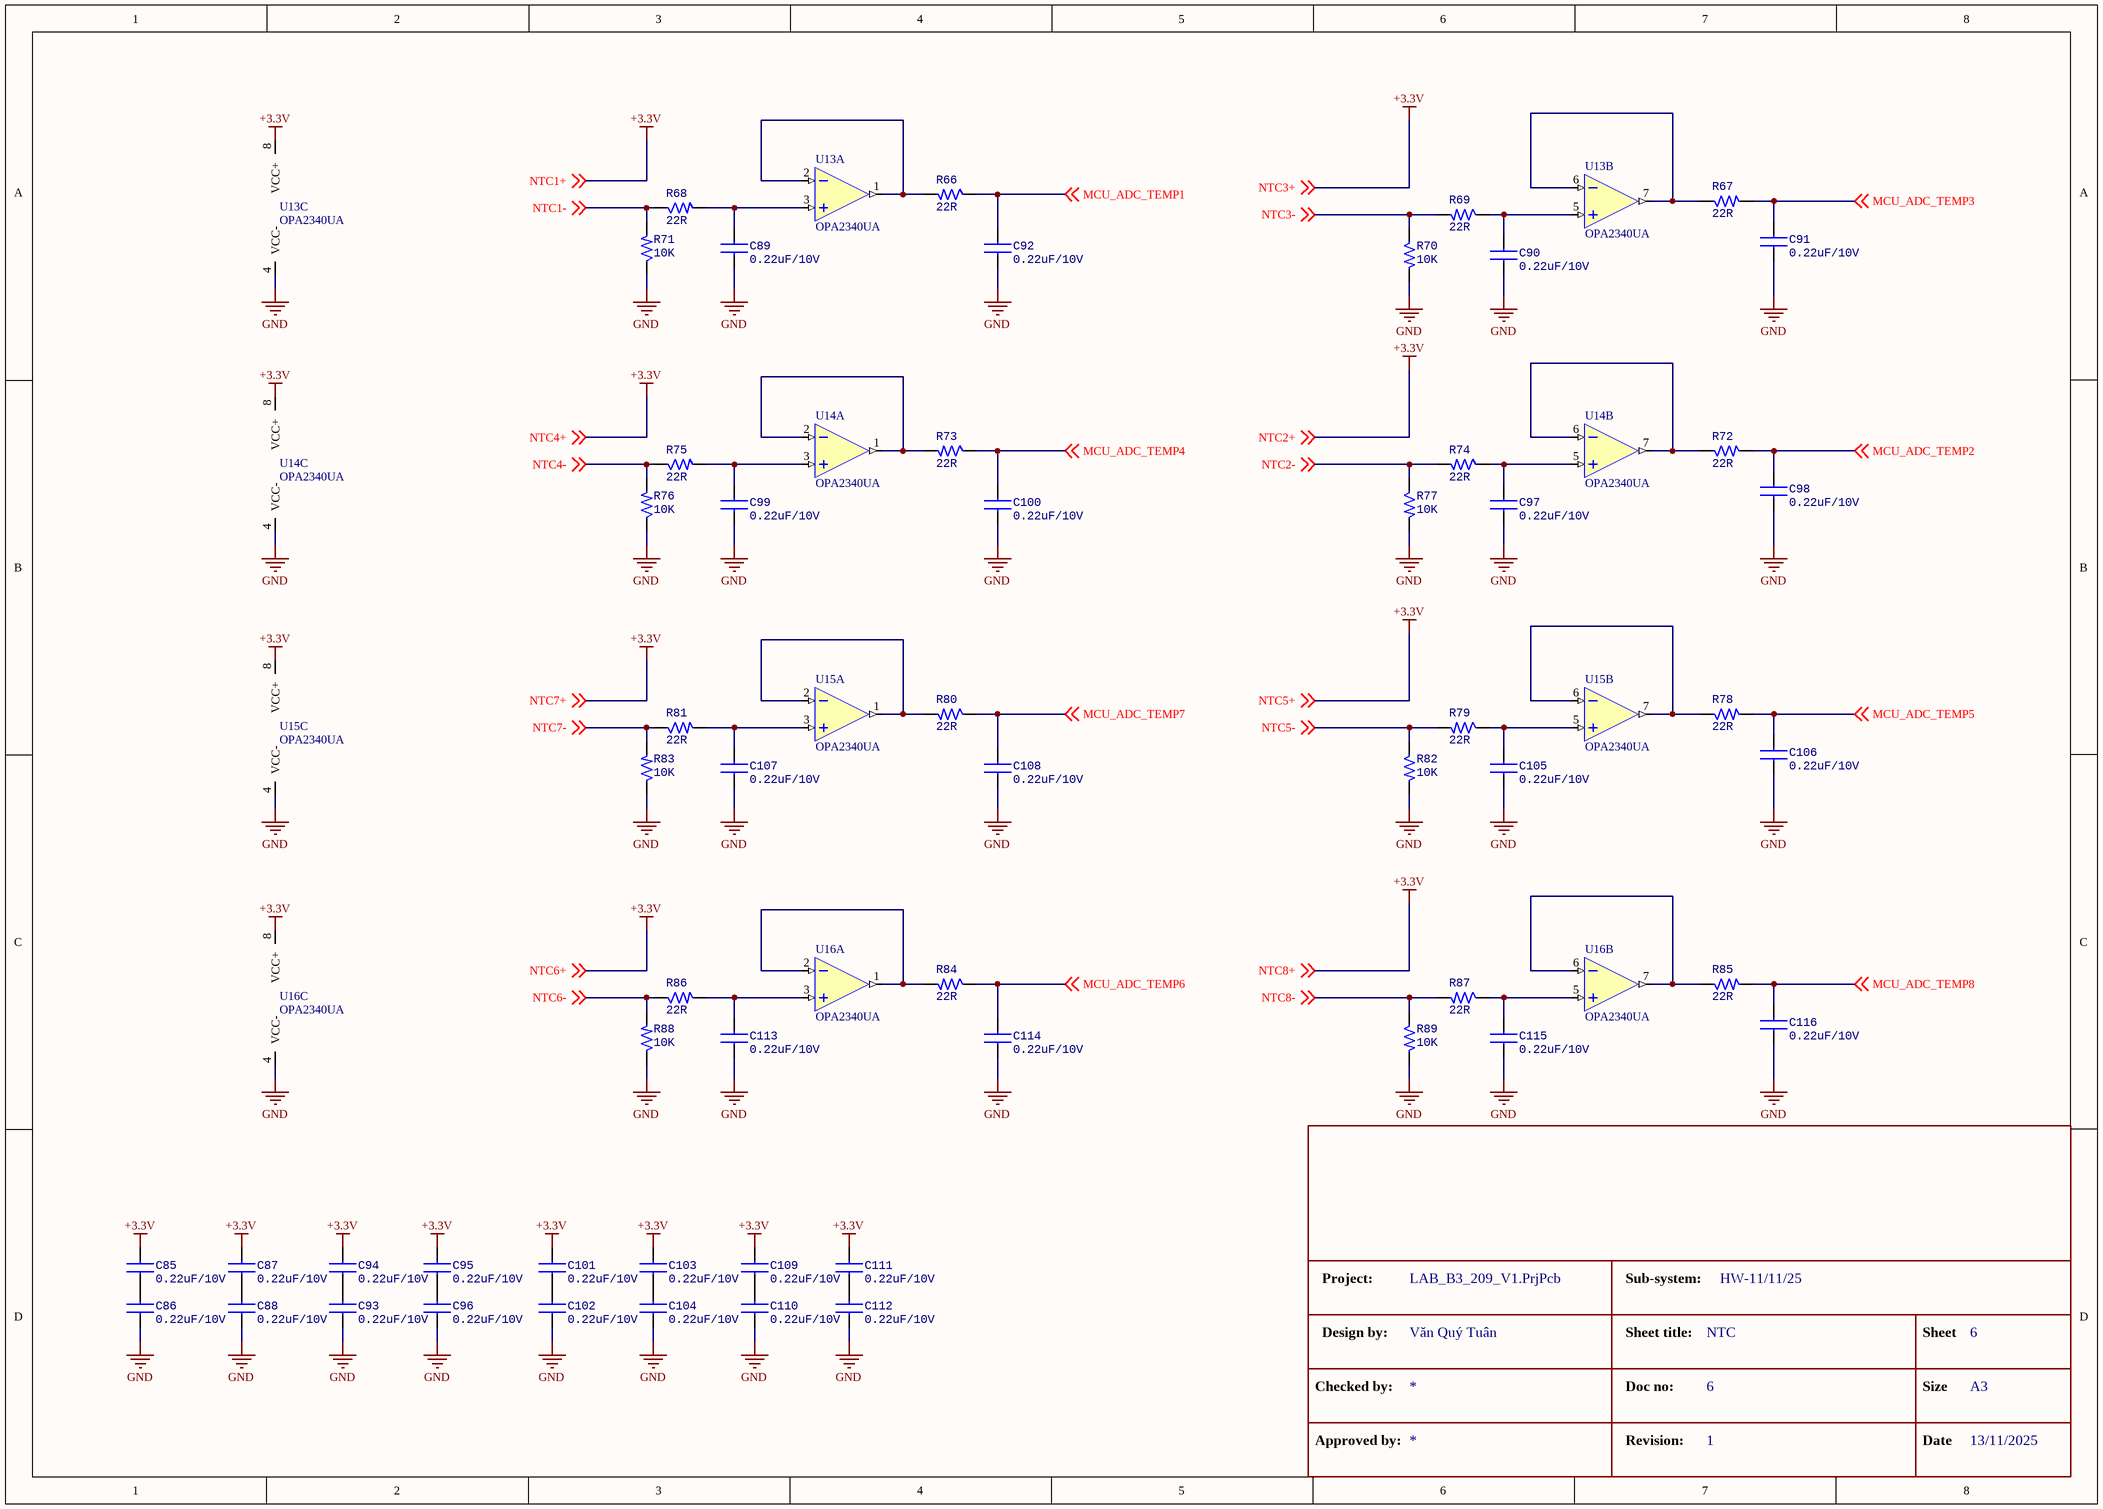
[diagram p5: NTC.SchDoc]

### Parts
C85  0.22uF/10V  [CAP-CER-0603]
C86  0.22uF/10V  [CAP-CER-0603]
C87  0.22uF/10V  [CAP-CER-0603]
C88  0.22uF/10V  [CAP-CER-0603]
C89  0.22uF/10V  [CAP-CER-0603]
C90  0.22uF/10V  [CAP-CER-0603]
C91  0.22uF/10V  [CAP-CER-0603]
C92  0.22uF/10V  [CAP-CER-0603]
C93  0.22uF/10V  [CAP-CER-0603]
C94  0.22uF/10V  [CAP-CER-0603]
C95  0.22uF/10V  [CAP-CER-0603]
C96  0.22uF/10V  [CAP-CER-0603]
C97  0.22uF/10V  [CAP-CER-0603]
C98  0.22uF/10V  [CAP-CER-0603]
C99  0.22uF/10V  [CAP-CER-0603]
C100  0.22uF/10V  [CAP-CER-0603]
C101  0.22uF/10V  [CAP-CER-0603]
C102  0.22uF/10V  [CAP-CER-0603]
C103  0.22uF/10V  [CAP-CER-0603]
C104  0.22uF/10V  [CAP-CER-0603]
C105  0.22uF/10V  [CAP-CER-0603]
C106  0.22uF/10V  [CAP-CER-0603]
C107  0.22uF/10V  [CAP-CER-0603]
C108  0.22uF/10V  [CAP-CER-0603]
C109  0.22uF/10V  [CAP-CER-0603]
C110  0.22uF/10V  [CAP-CER-0603]
C111  0.22uF/10V  [CAP-CER-0603]
C112  0.22uF/10V  [CAP-CER-0603]
C113  0.22uF/10V  [CAP-CER-0603]
C114  0.22uF/10V  [CAP-CER-0603]
C115  0.22uF/10V  [CAP-CER-0603]
C116  0.22uF/10V  [CAP-CER-0603]
R66  22R  [RES-SMD-0603]
R67  22R  [RES-SMD-0603]
R68  22R  [RES-SMD-0603]
R69  22R  [RES-SMD-0603]
R70  10K  [RES-SMD-0603]
R71  10K  [RES-SMD-0603]
R72  22R  [RES-SMD-0603]
R73  22R  [RES-SMD-0603]
R74  22R  [RES-SMD-0603]
R75  22R  [RES-SMD-0603]
R76  10K  [RES-SMD-0603]
R77  10K  [RES-SMD-0603]
R78  22R  [RES-SMD-0603]
R79  22R  [RES-SMD-0603]
R80  22R  [RES-SMD-0603]
R81  22R  [RES-SMD-0603]
R82  10K  [RES-SMD-0603]
R83  10K  [RES-SMD-0603]
R84  22R  [RES-SMD-0603]
R85  22R  [RES-SMD-0603]
R86  22R  [RES-SMD-0603]
R87  22R  [RES-SMD-0603]
R88  10K  [RES-SMD-0603]
R89  10K  [RES-SMD-0603]
U13  OPA2340UA  [SOIC-8]  (parts A,B,C of 3)
U14  OPA2340UA  [SOIC-8]  (parts A,B,C of 3)
U15  OPA2340UA  [SOIC-8]  (parts A,B,C of 3)
U16  OPA2340UA  [SOIC-8]  (parts A,B,C of 3)

### Nets
+3.3V: C85.1 C87.1 C94.1 C95.1 C101.1 C103.1 C109.1 C111.1 U13.8(VCC+) U14.8(VCC+) U15.8(VCC+) U16.8(VCC+) ; off-sheet NTC1+, off-sheet NTC3+, off-sheet NTC4+, off-sheet NTC2+, off-sheet NTC7+, off-sheet NTC5+, off-sheet NTC6+, off-sheet NTC8+  [also labelled NTC1+, NTC2+, NTC3+, NTC4+, NTC5+, NTC6+, NTC7+, NTC8+]
GND: C86.2 C88.2 C89.2 C90.2 C91.2 C92.2 C93.2 C96.2 C97.2 C98.2 C99.2 C100.2 C102.2 C104.2 C105.2 C106.2 C107.2 C108.2 C110.2 C112.2 C113.2 C114.2 C115.2 C116.2 R70.2 R71.1 R76.1 R77.2 R82.2 R83.1 R88.1 R89.2 U13.4(VCC-) U14.4(VCC-) U15.4(VCC-) U16.4(VCC-)
MCU_ADC_TEMP1: C92.1 R66.1 ; off-sheet MCU_ADC_TEMP1
MCU_ADC_TEMP2: C98.1 R72.2 ; off-sheet MCU_ADC_TEMP2
MCU_ADC_TEMP3: C91.1 R67.2 ; off-sheet MCU_ADC_TEMP3
MCU_ADC_TEMP4: C100.1 R73.1 ; off-sheet MCU_ADC_TEMP4
MCU_ADC_TEMP5: C106.1 R78.2 ; off-sheet MCU_ADC_TEMP5
MCU_ADC_TEMP6: C114.1 R84.1 ; off-sheet MCU_ADC_TEMP6
MCU_ADC_TEMP7: C108.1 R80.1 ; off-sheet MCU_ADC_TEMP7
MCU_ADC_TEMP8: C116.1 R85.2 ; off-sheet MCU_ADC_TEMP8
NTC1-: R68.1 R71.2 ; off-sheet NTC1-
NTC2-: R74.2 R77.1 ; off-sheet NTC2-
NTC3-: R69.2 R70.1 ; off-sheet NTC3-
NTC4-: R75.1 R76.2 ; off-sheet NTC4-
NTC5-: R79.2 R82.1 ; off-sheet NTC5-
NTC6-: R86.1 R88.2 ; off-sheet NTC6-
NTC7-: R81.1 R83.2 ; off-sheet NTC7-
NTC8-: R87.2 R89.1 ; off-sheet NTC8-
NetC85_2: C85.2 C86.1
NetC87_2: C87.2 C88.1
NetC89_1: C89.1 R68.2 U13.3(1IN+)
NetC90_1: C90.1 R69.1 U13.5(2IN+)
NetC93_1: C93.1 C94.2
NetC95_2: C95.2 C96.1
NetC97_1: C97.1 R74.1 U14.5(2IN+)
NetC99_1: C99.1 R75.2 U14.3(1IN+)
NetC101_2: C101.2 C102.1
NetC103_2: C103.2 C104.1
NetC105_1: C105.1 R79.1 U15.5(2IN+)
NetC107_1: C107.1 R81.2 U15.3(1IN+)
NetC109_2: C109.2 C110.1
NetC111_2: C111.2 C112.1
NetC113_1: C113.1 R86.2 U16.3(1IN+)
NetC115_1: C115.1 R87.1 U16.5(2IN+)
NetR66_2: R66.2 U13.1(1OUT) U13.2(1IN-)
NetR67_1: R67.1 U13.6(2IN-) U13.7(2OUT)
NetR72_1: R72.1 U14.6(2IN-) U14.7(2OUT)
NetR73_2: R73.2 U14.1(1OUT) U14.2(1IN-)
NetR78_1: R78.1 U15.6(2IN-) U15.7(2OUT)
NetR80_2: R80.2 U15.1(1OUT) U15.2(1IN-)
NetR84_2: R84.2 U16.1(1OUT) U16.2(1IN-)
NetR85_1: R85.1 U16.6(2IN-) U16.7(2OUT)

### Notes on the sheet
- Project:
- Sub-system:
- Checked by:
- Design by:
- Sheet title:
- Doc no:
- Sheet
- Size
- Approved by:
- Revision:
- Date
- Text

### Library data of the parts
C85-C116 = CAP-CER
R66-R89 = RES-SMD
U13-U16 = TL072CDT: Dual JFET Low-Noise Operational Amplifiers; Manufacturer: STMicroelectronics; Manufacturer Part Number: TL072CDT

## Sheet HEATER.SchDoc: HEATER
size A3; Date: 13/11/2025; DrawnBy: Văn Quý Tuân; SheetNumber: 7; SheetTotal: 10; Size: A3; Subsystem: HW-11/11/25
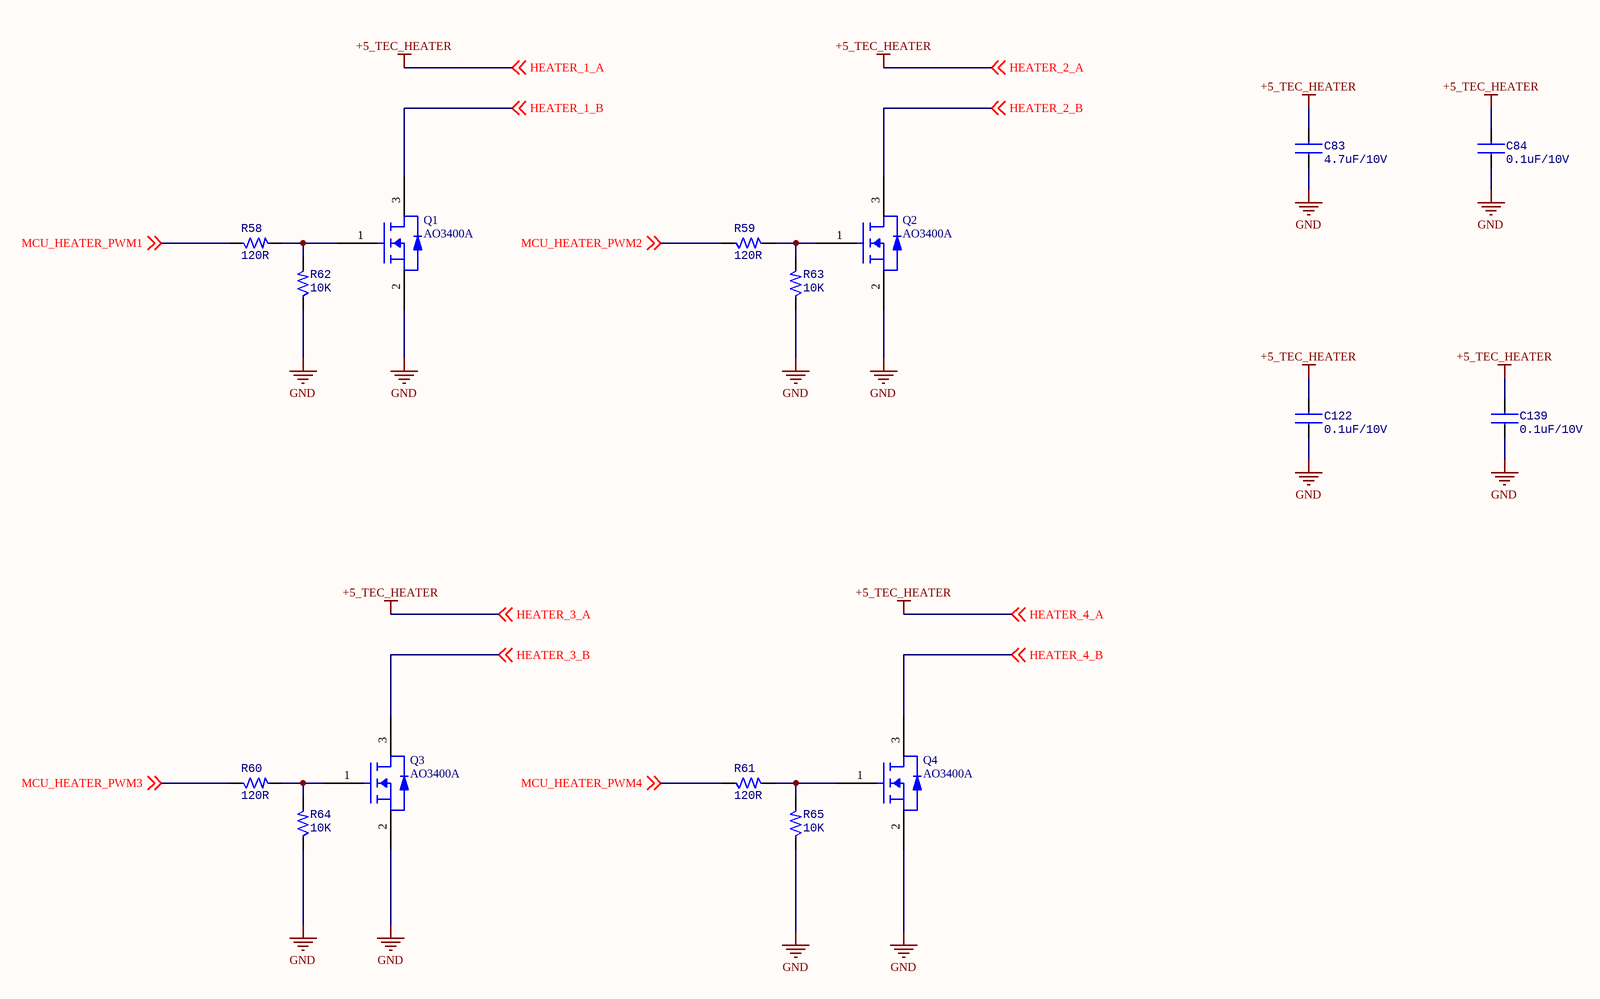
[diagram p6: HEATER.SchDoc]

### Parts
C83  4.7uF/10V  [CAP-CER-0603]
C84  0.1uF/10V  [CAP-CER-0603]
C122  0.1uF/10V  [CAP-CER-0603]
C139  0.1uF/10V  [CAP-CER-0603]
Q1  AO3400A  [SOT-23]
Q2  AO3400A  [SOT-23]
Q3  AO3400A  [SOT-23]
Q4  AO3400A  [SOT-23]
R58  120R  [RES-SMD-0603]
R59  120R  [RES-SMD-0603]
R60  120R  [RES-SMD-0603]
R61  120R  [RES-SMD-0603]
R62  10K  [RES-SMD-0603]
R63  10K  [RES-SMD-0603]
R64  10K  [RES-SMD-0603]
R65  10K  [RES-SMD-0603]

### Nets
+5_TEC_HEATER: C83.1 C84.1 C122.1 C139.1 ; off-sheet HEATER_1_A, off-sheet HEATER_2_A, off-sheet HEATER_3_A, off-sheet HEATER_4_A  [also labelled HEATER_1_A, HEATER_2_A, HEATER_3_A, HEATER_4_A]
GND: C83.2 C84.2 C122.2 C139.2 Q1.2 Q2.2 Q3.2 Q4.2 R62.1 R63.1 R64.1 R65.1
HEATER_1_B: Q1.3 ; off-sheet HEATER_1_B
HEATER_2_B: Q2.3 ; off-sheet HEATER_2_B
HEATER_3_B: Q3.3 ; off-sheet HEATER_3_B
HEATER_4_B: Q4.3 ; off-sheet HEATER_4_B
MCU_HEATER_PWM1: R58.1 ; off-sheet MCU_HEATER_PWM1
MCU_HEATER_PWM2: R59.1 ; off-sheet MCU_HEATER_PWM2
MCU_HEATER_PWM3: R60.1 ; off-sheet MCU_HEATER_PWM3
MCU_HEATER_PWM4: R61.1 ; off-sheet MCU_HEATER_PWM4
NetQ1_1: Q1.1 R58.2 R62.2
NetQ2_1: Q2.1 R59.2 R63.2
NetQ3_1: Q3.1 R60.2 R64.2
NetQ4_1: Q4.1 R61.2 R65.2

### Notes on the sheet
- Project:
- Sub-system:
- Checked by:
- Design by:
- Sheet title:
- Doc no:
- Sheet
- Size
- Approved by:
- Revision:
- Date
- Text

### Library data of the parts
C83 C84 C122 C139 = CAP-CER
Q1-Q4 = 2N7002NXAKR: MOSFET N-Channel Vds=60V Id=300mA with ESD Protection; Manufacturer: Nexperia; Manufacturer Part Number: 2N7002NXAKR
R58-R65 = RES-SMD

## Sheet TEC_DRV.SchDoc: TEC_DRV
size A3; Date: 13/11/2025; DrawnBy: Văn Quý Tuân; DocumentNumber: 1; Revision: 1; SheetNumber: 8; SheetTotal: 10; Size: A3; Subsystem: HW-11/11/25
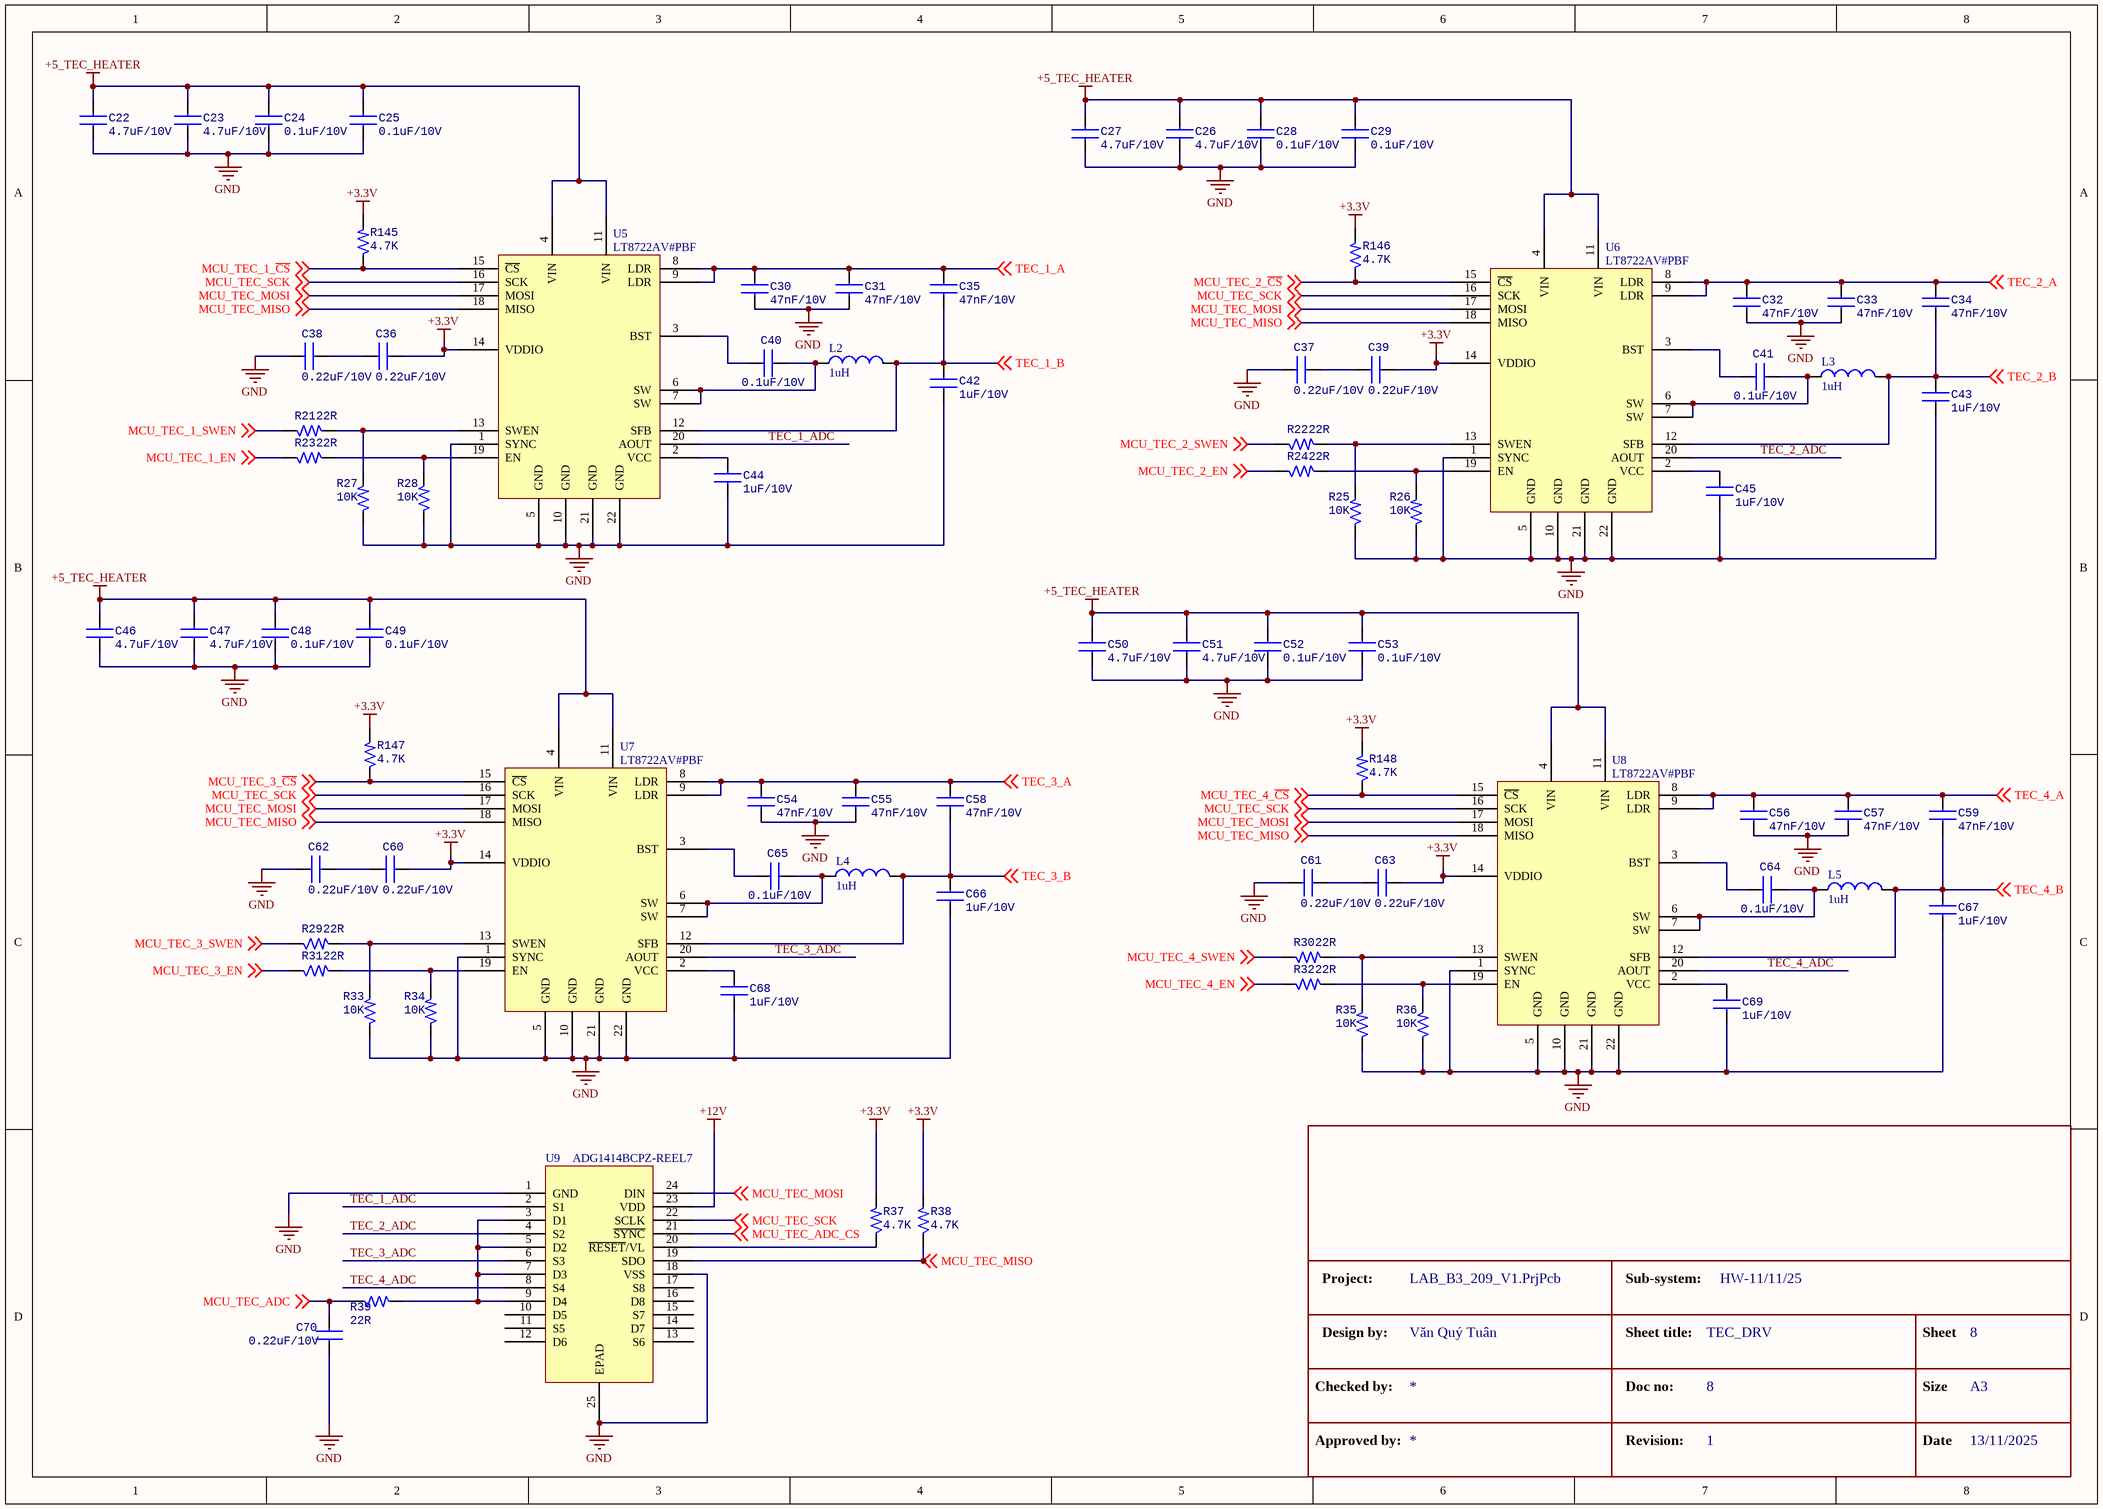
[diagram p7: TEC_DRV.SchDoc]

### Parts
C22  4.7uF/10V  [CAP-CER-0603]
C23  4.7uF/10V  [CAP-CER-0603]
C24  0.1uF/10V  [CAP-CER-0603]
C25  0.1uF/10V  [CAP-CER-0603]
C26  4.7uF/10V  [CAP-CER-0603]
C27  4.7uF/10V  [CAP-CER-0603]
C28  0.1uF/10V  [CAP-CER-0603]
C29  0.1uF/10V  [CAP-CER-0603]
C30  47nF/10V  [CAP-CER-0603]
C31  47nF/10V  [CAP-CER-0603]
C32  47nF/10V  [CAP-CER-0603]
C33  47nF/10V  [CAP-CER-0603]
C34  47nF/10V  [CAP-CER-0603]
C35  47nF/10V  [CAP-CER-0603]
C36  0.22uF/10V  [CAP-CER-0603]
C37  0.22uF/10V  [CAP-CER-0603]
C38  0.22uF/10V  [CAP-CER-0603]
C39  0.22uF/10V  [CAP-CER-0603]
C40  0.1uF/10V  [CAP-CER-0603]
C41  0.1uF/10V  [CAP-CER-0603]
C42  1uF/10V  [CAP-CER-0603]
C43  1uF/10V  [CAP-CER-0603]
C44  1uF/10V  [CAP-CER-0603]
C45  1uF/10V  [CAP-CER-0603]
C46  4.7uF/10V  [CAP-CER-0603]
C47  4.7uF/10V  [CAP-CER-0603]
C48  0.1uF/10V  [CAP-CER-0603]
C49  0.1uF/10V  [CAP-CER-0603]
C50  4.7uF/10V  [CAP-CER-0603]
C51  4.7uF/10V  [CAP-CER-0603]
C52  0.1uF/10V  [CAP-CER-0603]
C53  0.1uF/10V  [CAP-CER-0603]
C54  47nF/10V  [CAP-CER-0603]
C55  47nF/10V  [CAP-CER-0603]
C56  47nF/10V  [CAP-CER-0603]
C57  47nF/10V  [CAP-CER-0603]
C58  47nF/10V  [CAP-CER-0603]
C59  47nF/10V  [CAP-CER-0603]
C60  0.22uF/10V  [CAP-CER-0603]
C61  0.22uF/10V  [CAP-CER-0603]
C62  0.22uF/10V  [CAP-CER-0603]
C63  0.22uF/10V  [CAP-CER-0603]
C64  0.1uF/10V  [CAP-CER-0603]
C65  0.1uF/10V  [CAP-CER-0603]
C66  1uF/10V  [CAP-CER-0603]
C67  1uF/10V  [CAP-CER-0603]
C68  1uF/10V  [CAP-CER-0603]
C69  1uF/10V  [CAP-CER-0603]
C70  0.22uF/10V  [CAP-CER-0603]
L2  1uH  [INDUCTOR-FIXED IND 1UH 4A 38 MOHM SMD]
L3  1uH  [INDUCTOR-FIXED IND 1UH 4A 38 MOHM SMD]
L4  1uH  [INDUCTOR-FIXED IND 1UH 4A 38 MOHM SMD]
L5  1uH  [INDUCTOR-FIXED IND 1UH 4A 38 MOHM SMD]
R21  22R  [RES-SMD-0603]
R22  22R  [RES-SMD-0603]
R23  22R  [RES-SMD-0603]
R24  22R  [RES-SMD-0603]
R25  10K  [RES-SMD-0603]
R26  10K  [RES-SMD-0603]
R27  10K  [RES-SMD-0603]
R28  10K  [RES-SMD-0603]
R29  22R  [RES-SMD-0603]
R30  22R  [RES-SMD-0603]
R31  22R  [RES-SMD-0603]
R32  22R  [RES-SMD-0603]
R33  10K  [RES-SMD-0603]
R34  10K  [RES-SMD-0603]
R35  10K  [RES-SMD-0603]
R36  10K  [RES-SMD-0603]
R37  4.7K  [RES-SMD-0603]
R38  4.7K  [RES-SMD-0603]
R39  22R  [RES-SMD-0603]
R145  4.7K  [RES-SMD-0603]
R146  4.7K  [RES-SMD-0603]
R147  4.7K  [RES-SMD-0603]
R148  4.7K  [RES-SMD-0603]
U5  LT8722AV#PBF  [LT8722AV#PBF]
U6  LT8722AV#PBF  [LT8722AV#PBF]
U7  LT8722AV#PBF  [LT8722AV#PBF]
U8  LT8722AV#PBF  [LT8722AV#PBF]
U9  ADG1414BCPZ-REEL7  [ADG1414BCPZ-REEL7]

### Nets
+3.3V: C36.2 C39.2 C60.2 C63.2 R37.2 R38.2 R145.2 R146.2 R147.2 R148.2 U5.14(VDDIO) U6.14(VDDIO) U7.14(VDDIO) U8.14(VDDIO)
+5_TEC_HEATER: C22.1 C23.1 C24.1 C25.1 C26.1 C27.1 C28.1 C29.1 C46.1 C47.1 C48.1 C49.1 C50.1 C51.1 C52.1 C53.1 U5.4(VIN) U5.11(VIN) U6.4(VIN) U6.11(VIN) U7.4(VIN) U7.11(VIN) U8.4(VIN) U8.11(VIN)
+12V: U9.23(VDD)
GND: C22.2 C23.2 C24.2 C25.2 C26.2 C27.2 C28.2 C29.2 C30.1 C31.1 C32.1 C33.1 C37.2 C38.2 C42.1 C43.1 C44.1 C45.1 C46.2 C47.2 C48.2 C49.2 C50.2 C51.2 C52.2 C53.2 C54.1 C55.1 C56.1 C57.1 C61.2 C62.2 C66.1 C67.1 C68.1 C69.1 C70.2 R25.1 R26.1 R27.1 R28.1 R33.1 R34.1 R35.1 R36.1 U5.1(SYNC) U5.5(GND) U5.10(GND) U5.21(GND) U5.22(GND) U6.1(SYNC) U6.5(GND) U6.10(GND) U6.21(GND) U6.22(GND) U7.1(SYNC) U7.5(GND) U7.10(GND) U7.21(GND) U7.22(GND) U8.1(SYNC) U8.5(GND) U8.10(GND) U8.21(GND) U8.22(GND) U9.1(GND) U9.18(VSS) U9.25(EPAD)
MCU_TEC_1_~{CS}: R145.1 U5.15(~{CS}) ; off-sheet MCU_TEC_1_~{CS}
MCU_TEC_1_EN: R23.1 ; off-sheet MCU_TEC_1_EN
MCU_TEC_1_SWEN: R21.1 ; off-sheet MCU_TEC_1_SWEN
MCU_TEC_2_~{CS}: R146.1 U6.15(~{CS}) ; off-sheet MCU_TEC_2_~{CS}
MCU_TEC_2_EN: R24.1 ; off-sheet MCU_TEC_2_EN
MCU_TEC_2_SWEN: R22.1 ; off-sheet MCU_TEC_2_SWEN
MCU_TEC_3_~{CS}: R147.1 U7.15(~{CS}) ; off-sheet MCU_TEC_3_~{CS}
MCU_TEC_3_EN: R31.1 ; off-sheet MCU_TEC_3_EN
MCU_TEC_3_SWEN: R29.1 ; off-sheet MCU_TEC_3_SWEN
MCU_TEC_4_~{CS}: R148.1 U8.15(~{CS}) ; off-sheet MCU_TEC_4_~{CS}
MCU_TEC_4_EN: R32.1 ; off-sheet MCU_TEC_4_EN
MCU_TEC_4_SWEN: R30.1 ; off-sheet MCU_TEC_4_SWEN
MCU_TEC_ADC: C70.1 R39.1 ; off-sheet MCU_TEC_ADC
MCU_TEC_ADC_CS: U9.21(~{SYNC}) ; off-sheet MCU_TEC_ADC_CS
MCU_TEC_MISO: R38.1 U5.18(MISO) U6.18(MISO) U7.18(MISO) U8.18(MISO) U9.19(SDO) ; off-sheet MCU_TEC_MISO
MCU_TEC_MOSI: U5.17(MOSI) U6.17(MOSI) U7.17(MOSI) U8.17(MOSI) U9.24(DIN) ; off-sheet MCU_TEC_MOSI
MCU_TEC_SCK: U5.16(SCK) U6.16(SCK) U7.16(SCK) U8.16(SCK) U9.22(SCLK) ; off-sheet MCU_TEC_SCK
TEC_1_A: C30.2 C31.2 C35.2 U5.8(LDR) U5.9(LDR) ; off-sheet TEC_1_A
TEC_1_ADC: U5.20(AOUT) U9.2(S1)
TEC_1_B: C35.1 C42.2 L2.2 U5.12(SFB) ; off-sheet TEC_1_B
TEC_2_A: C32.2 C33.2 C34.2 U6.8(LDR) U6.9(LDR) ; off-sheet TEC_2_A
TEC_2_ADC: U6.20(AOUT) U9.4(S2)
TEC_2_B: C34.1 C43.2 L3.2 U6.12(SFB) ; off-sheet TEC_2_B
TEC_3_A: C54.2 C55.2 C58.2 U7.8(LDR) U7.9(LDR) ; off-sheet TEC_3_A
TEC_3_ADC: U7.20(AOUT) U9.6(S3)
TEC_3_B: C58.1 C66.2 L4.2 U7.12(SFB) ; off-sheet TEC_3_B
TEC_4_A: C56.2 C57.2 C59.2 U8.8(LDR) U8.9(LDR) ; off-sheet TEC_4_A
TEC_4_ADC: U8.20(AOUT) U9.8(S4)
TEC_4_B: C59.1 C67.2 L5.2 U8.12(SFB) ; off-sheet TEC_4_B
NetC36_1: C36.1 C38.1
NetC37_1: C37.1 C39.1
NetC40_1: C40.1 L2.1 U5.6(SW) U5.7(SW)
NetC40_2: C40.2 U5.3(BST)
NetC41_1: C41.1 L3.1 U6.6(SW) U6.7(SW)
NetC41_2: C41.2 U6.3(BST)
NetC44_2: C44.2 U5.2(VCC)
NetC45_2: C45.2 U6.2(VCC)
NetC60_1: C60.1 C62.1
NetC61_1: C61.1 C63.1
NetC64_1: C64.1 L5.1 U8.6(SW) U8.7(SW)
NetC64_2: C64.2 U8.3(BST)
NetC65_1: C65.1 L4.1 U7.6(SW) U7.7(SW)
NetC65_2: C65.2 U7.3(BST)
NetC68_2: C68.2 U7.2(VCC)
NetC69_2: C69.2 U8.2(VCC)
NetR21_2: R21.2 R27.2 U5.13(SWEN)
NetR22_2: R22.2 R25.2 U6.13(SWEN)
NetR23_2: R23.2 R28.2 U5.19(EN)
NetR24_2: R24.2 R26.2 U6.19(EN)
NetR29_2: R29.2 R33.2 U7.13(SWEN)
NetR30_2: R30.2 R35.2 U8.13(SWEN)
NetR31_2: R31.2 R34.2 U7.19(EN)
NetR32_2: R32.2 R36.2 U8.19(EN)
NetR37_1: R37.1 U9.20(~{RESET}/VL)
NetR39_2: R39.2 U9.3(D1) U9.5(D2) U9.7(D3) U9.9(D4)

Not connected (* = marked no-connect by the designer): U9 10(D5) 11(S5) 12(D6) 13(S6) 14(D7) 15(S7) 16(D8) 17(S8)

### Notes on the sheet
- Project:
- Sub-system:
- Checked by:
- Design by:
- Sheet title:
- Doc no:
- Sheet
- Size
- Approved by:
- Revision:
- Date
- Text

### Library data of the parts
C22-C70 = CAP-CER
L2-L5 = INDUCT-SMD: MP: LQM18PZ2R2MFHD; MF: Murata; Price: None; Package: 1608 Murata; Value: *; SnapEDA_Link: https://www.snapeda.com/parts/LQM18PZ2R2MFHD/Murata/view-part/1498702/?ref=snap; Availability: Good; Check_prices: https://www.snapeda.com/parts/LQM18PZ2R2MFHD/Murata/view-part/1498702/?ref=eda; Purchase-URL: https://pricing.snapeda.com/search/part/LQM18PZ2R2MFHD/?ref=eda
R21-R39 R145-R148 = RES-SMD

## Sheet EXP_OBC_COMM.SchDoc: EXP_OBC_COMM
size A3; Date: 13/11/2025; DrawnBy: Văn Quý Tuân; Revision: 1; SheetNumber: 9; SheetTotal: 10; Size: A3; Subsystem: HW-11/11/25
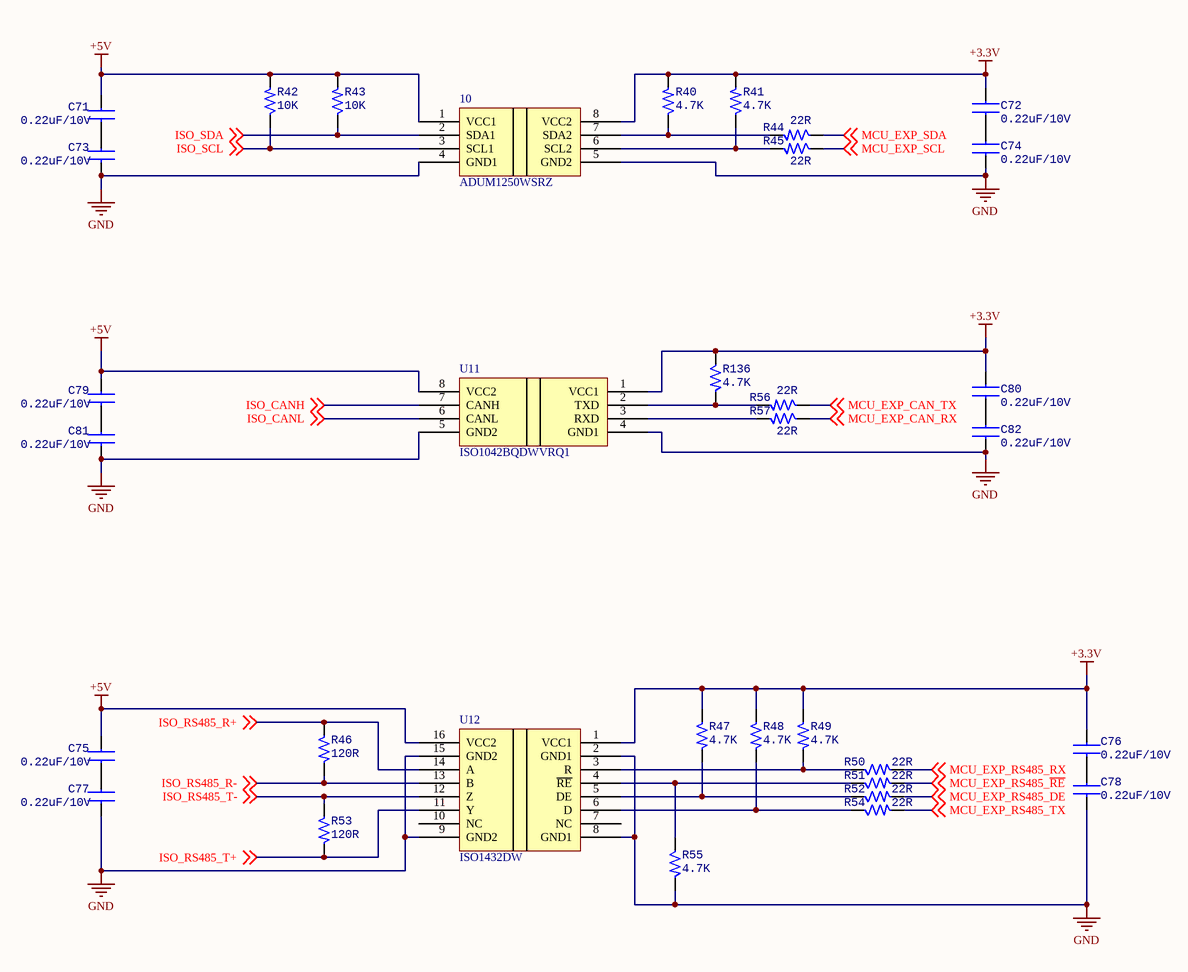
[diagram p8: EXP_OBC_COMM.SchDoc]

### Parts
10  ADUM1250WSRZ  [ADUM1250WSRZ]
C71  0.22uF/10V  [CAP-CER-0603]
C72  0.22uF/10V  [CAP-CER-0603]
C73  0.22uF/10V  [CAP-CER-0603]
C74  0.22uF/10V  [CAP-CER-0603]
C75  0.22uF/10V  [CAP-CER-0603]
C76  0.22uF/10V  [CAP-CER-0603]
C77  0.22uF/10V  [CAP-CER-0603]
C78  0.22uF/10V  [CAP-CER-0603]
C79  0.22uF/10V  [CAP-CER-0603]
C80  0.22uF/10V  [CAP-CER-0603]
C81  0.22uF/10V  [CAP-CER-0603]
C82  0.22uF/10V  [CAP-CER-0603]
R40  4.7K  [RES-SMD-0603]
R41  4.7K  [RES-SMD-0603]
R42  10K  [RES-SMD-0603]
R43  10K  [RES-SMD-0603]
R44  22R  [RES-SMD-0603]
R45  22R  [RES-SMD-0603]
R46  120R  [RES-SMD-0603]
R47  4.7K  [RES-SMD-0603]
R48  4.7K  [RES-SMD-0603]
R49  4.7K  [RES-SMD-0603]
R50  22R  [RES-SMD-0603]
R51  22R  [RES-SMD-0603]
R52  22R  [RES-SMD-0603]
R53  120R  [RES-SMD-0603]
R54  22R  [RES-SMD-0603]
R55  4.7K  [RES-SMD-0603]
R56  22R  [RES-SMD-0603]
R57  22R  [RES-SMD-0603]
R136  4.7K  [RES-SMD-0603]
U11  ISO1042BQDWVRQ1  [ISO1042BQDWVRQ1]
U12  ISO1432DW  [ISO1432DW]

### Nets
+3.3V: 10.8(VCC2) C72.2 C76.2 C80.2 R40.2 R41.2 R47.1 R48.1 R49.1 R136.1 U11.1(VCC1) U12.1(VCC1)
+5V: 10.1(VCC1) C71.2 C75.2 C79.2 R42.2 R43.2 U11.8(VCC2) U12.16(VCC2)
GND: 10.4(GND1) 10.5(GND2) C73.1 C74.1 C77.1 C78.1 C81.1 C82.1 R55.2 U11.4(GND1) U11.5(GND2) U12.2(GND1) U12.8(GND1) U12.9(GND2) U12.15(GND2)
ISO_CANH: U11.7(CANH) ; off-sheet ISO_CANH
ISO_CANL: U11.6(CANL) ; off-sheet ISO_CANL
ISO_RS485_R+: R46.1 U12.14(A) ; off-sheet ISO_RS485_R+
ISO_RS485_R-: R46.2 U12.13(B) ; off-sheet ISO_RS485_R-
ISO_RS485_T+: R53.2 U12.11(Y) ; off-sheet ISO_RS485_T+
ISO_RS485_T-: R53.1 U12.12(Z) ; off-sheet ISO_RS485_T-
ISO_SCL: 10.3(SCL1) R42.1 ; off-sheet ISO_SCL
ISO_SDA: 10.2(SDA1) R43.1 ; off-sheet ISO_SDA
MCU_EXP_CAN_RX: R57.1 ; off-sheet MCU_EXP_CAN_RX
MCU_EXP_CAN_TX: R56.1 ; off-sheet MCU_EXP_CAN_TX
MCU_EXP_RS485_DE: R52.2 ; off-sheet MCU_EXP_RS485_DE
MCU_EXP_RS485_~{RE}: R51.2 ; off-sheet MCU_EXP_RS485_~{RE}
MCU_EXP_RS485_RX: R50.2 ; off-sheet MCU_EXP_RS485_RX
MCU_EXP_RS485_TX: R54.2 ; off-sheet MCU_EXP_RS485_TX
MCU_EXP_SCL: R45.1 ; off-sheet MCU_EXP_SCL
MCU_EXP_SDA: R44.1 ; off-sheet MCU_EXP_SDA
Net10_6: 10.6(SCL2) R41.1 R45.2
Net10_7: 10.7(SDA2) R40.1 R44.2
NetC71_1: C71.1 C73.2
NetC72_1: C72.1 C74.2
NetC75_1: C75.1 C77.2
NetC76_1: C76.1 C78.2
NetC79_1: C79.1 C81.2
NetC80_1: C80.1 C82.2
NetR47_2: R47.2 R52.1 U12.5(DE)
NetR48_2: R48.2 R54.1 U12.6(D)
NetR49_2: R49.2 R50.1 U12.3(R)
NetR51_1: R51.1 R55.1 U12.4(~{RE})
NetR56_2: R56.2 R136.2 U11.2(TXD)
NetR57_2: R57.2 U11.3(RXD)

Not connected (* = marked no-connect by the designer): U12 7(NC) 10(NC)

### Notes on the sheet
- Project:
- Sub-system:
- Checked by:
- Design by:
- Sheet title:
- Doc no:
- Sheet
- Size
- Approved by:
- Revision:
- Date
- Text

### Library data of the parts
C71-C82 = CAP-CER
R40-R57 R136 = RES-SMD

## Sheet HEADER.SchDoc: HEADER
size A3; Date: 13/11/2025; DrawnBy: Văn Quý Tuân; Revision: 1; SheetNumber: 10; SheetTotal: 10; Subsystem: HW-11/11/25; Size: A3
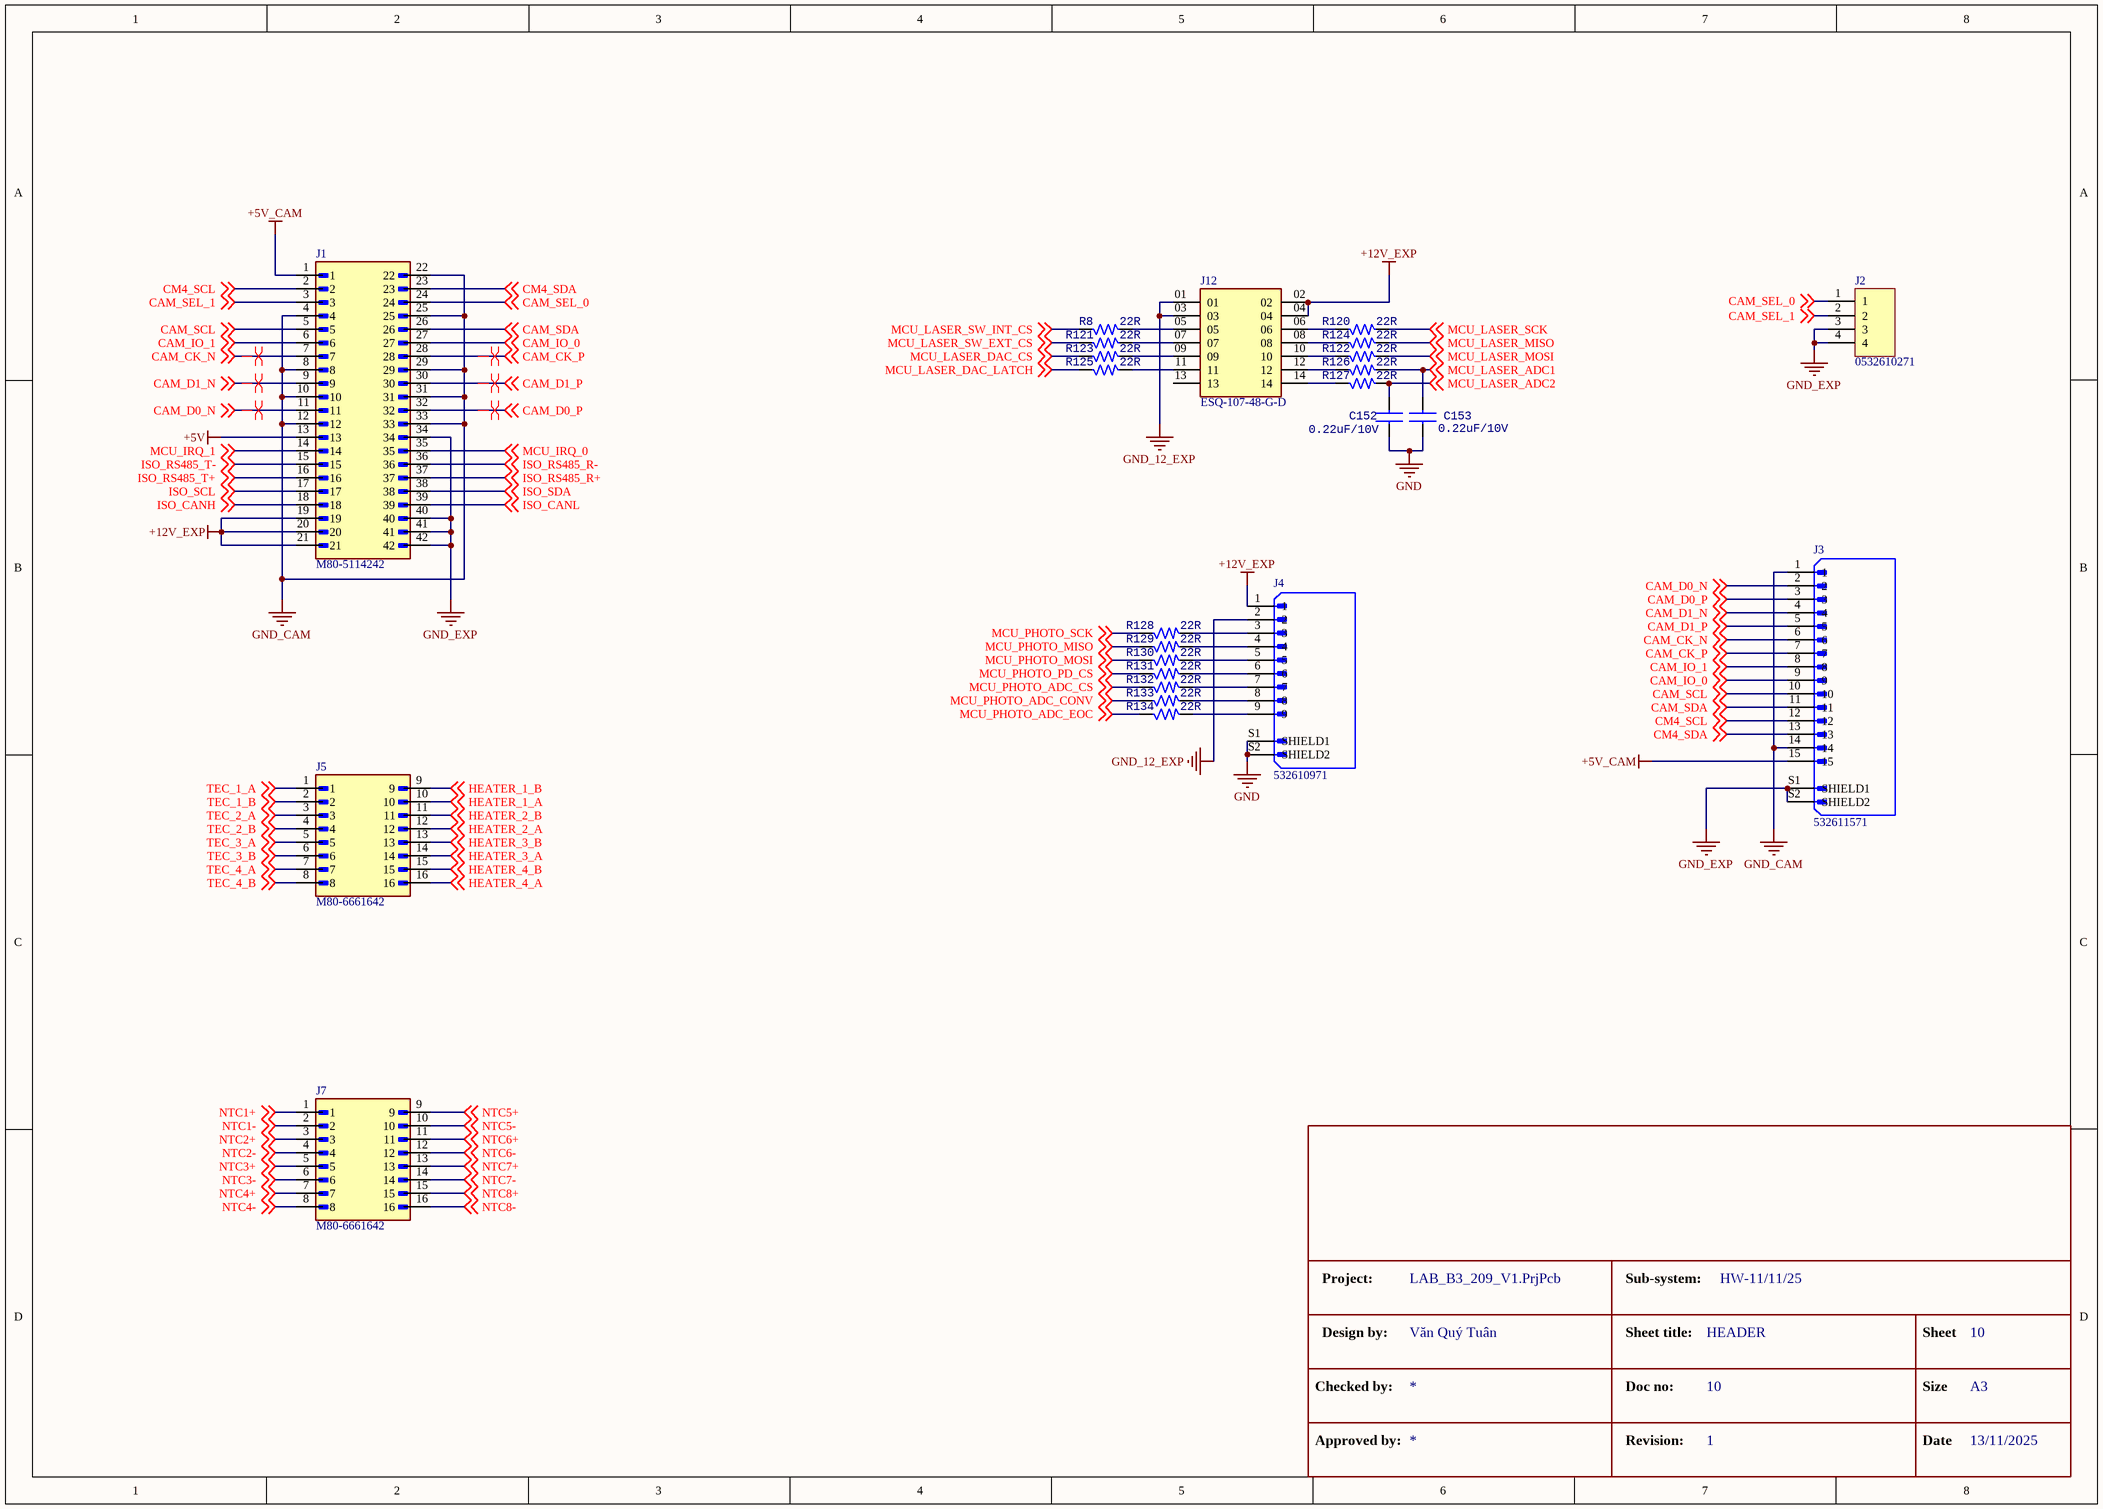
[diagram p9: HEADER.SchDoc]

### Parts
C152  0.22uF/10V  [CAP-CER-0603]
C153  0.22uF/10V  [CAP-CER-0603]
J1  M80-5114242  [HARWIN_M80-5114242]
J2  0532610271  [CON4_653104131822_SMD]
J3  532611571  [MOLEX_532611571]
J4  532610971  [MOLEX_532610971]
J5  M80-6661642  [HARWIN_M80-6661642]
J7  M80-6661642  [HARWIN_M80-6661642]
J12  ESQ-107-48-G-D  [SAMTEC_ESQ-107-48-G-D]
R8  22R  [RES-SMD-0603]
R120  22R  [RES-SMD-0603]
R121  22R  [RES-SMD-0603]
R122  22R  [RES-SMD-0603]
R123  22R  [RES-SMD-0603]
R124  22R  [RES-SMD-0603]
R125  22R  [RES-SMD-0603]
R126  22R  [RES-SMD-0603]
R127  22R  [RES-SMD-0603]
R128  22R  [RES-SMD-0603]
R129  22R  [RES-SMD-0603]
R130  22R  [RES-SMD-0603]
R131  22R  [RES-SMD-0603]
R132  22R  [RES-SMD-0603]
R133  22R  [RES-SMD-0603]
R134  22R  [RES-SMD-0603]

### Nets
+5V: J1.13
+5V_CAM: J1.1 J3.15
+12V_EXP: J1.19 J1.20 J1.21 J4.1 J12.02 J12.04
GND: C152.2 C153.2 J1.34 J1.40 J1.41 J1.42 J2.3 J2.4 J3.S1(SHIELD1) J3.S2(SHIELD2) J4.S1(SHIELD1) J4.S2(SHIELD2)  [also labelled GND_EXP]
GND_12_EXP: J4.2 J12.01 J12.03
GND_CAM: J1.4 J1.8 J1.10 J1.12 J1.22 J1.25 J1.29 J1.31 J1.33 J3.1 J3.14
HEATER_1_A: J5.10 J5.12 J5.14 J5.16 ; off-sheet HEATER_1_A, off-sheet HEATER_2_A, off-sheet HEATER_3_A, off-sheet HEATER_4_A  [also labelled HEATER_2_A, HEATER_3_A, HEATER_4_A]  [project net +5_TEC_HEATER]
NTC1+: J7.1 J7.3 J7.5 J7.7 J7.9 J7.11 J7.13 J7.15 ; off-sheet NTC5+, off-sheet NTC6+, off-sheet NTC7+, off-sheet NTC8+, off-sheet NTC1+, off-sheet NTC2+, off-sheet NTC3+, off-sheet NTC4+  [also labelled NTC2+, NTC3+, NTC4+, NTC5+, NTC6+, NTC7+, NTC8+]  [project net +3.3V]
CAM_CK_N: J1.7 J3.6 ; off-sheet CAM_CK_N
CAM_CK_P: J1.28 J3.7 ; off-sheet CAM_CK_P
CAM_D0_N: J1.11 J3.2 ; off-sheet CAM_D0_N
CAM_D0_P: J1.32 J3.3 ; off-sheet CAM_D0_P
CAM_D1_N: J1.9 J3.4 ; off-sheet CAM_D1_N
CAM_D1_P: J1.30 J3.5 ; off-sheet CAM_D1_P
CAM_IO_0: J1.27 J3.9 ; off-sheet CAM_IO_0
CAM_IO_1: J1.6 J3.8 ; off-sheet CAM_IO_1
CAM_SCL: J1.5 J3.10 ; off-sheet CAM_SCL
CAM_SDA: J1.26 J3.11 ; off-sheet CAM_SDA
CAM_SEL_0: J1.24 J2.1 ; off-sheet CAM_SEL_0
CAM_SEL_1: J1.3 J2.2 ; off-sheet CAM_SEL_1
CM4_SCL: J1.2 J3.12 ; off-sheet CM4_SCL
CM4_SDA: J1.23 J3.13 ; off-sheet CM4_SDA
HEATER_1_B: J5.9 ; off-sheet HEATER_1_B
HEATER_2_B: J5.11 ; off-sheet HEATER_2_B
HEATER_3_B: J5.13 ; off-sheet HEATER_3_B
HEATER_4_B: J5.15 ; off-sheet HEATER_4_B
ISO_CANH: J1.18 ; off-sheet ISO_CANH
ISO_CANL: J1.39 ; off-sheet ISO_CANL
ISO_RS485_R+: J1.37 ; off-sheet ISO_RS485_R+
ISO_RS485_R-: J1.36 ; off-sheet ISO_RS485_R-
ISO_RS485_T+: J1.16 ; off-sheet ISO_RS485_T+
ISO_RS485_T-: J1.15 ; off-sheet ISO_RS485_T-
ISO_SCL: J1.17 ; off-sheet ISO_SCL
ISO_SDA: J1.38 ; off-sheet ISO_SDA
MCU_IRQ_0: J1.35 ; off-sheet MCU_IRQ_0
MCU_IRQ_1: J1.14 ; off-sheet MCU_IRQ_1
MCU_LASER_ADC1: C153.1 R126.2 ; off-sheet MCU_LASER_ADC1
MCU_LASER_ADC2: C152.1 R127.2 ; off-sheet MCU_LASER_ADC2
MCU_LASER_DAC_CS: R123.1 ; off-sheet MCU_LASER_DAC_CS
MCU_LASER_DAC_LATCH: R125.1 ; off-sheet MCU_LASER_DAC_LATCH
MCU_LASER_MISO: R124.2 ; off-sheet MCU_LASER_MISO
MCU_LASER_MOSI: R122.2 ; off-sheet MCU_LASER_MOSI
MCU_LASER_SCK: R120.2 ; off-sheet MCU_LASER_SCK
MCU_LASER_SW_EXT_CS: R121.1 ; off-sheet MCU_LASER_SW_EXT_CS
MCU_LASER_SW_INT_CS: R8.1 ; off-sheet MCU_LASER_SW_INT_CS
MCU_PHOTO_ADC_CONV: R133.1 ; off-sheet MCU_PHOTO_ADC_CONV
MCU_PHOTO_ADC_CS: R132.1 ; off-sheet MCU_PHOTO_ADC_CS
MCU_PHOTO_ADC_EOC: R134.1 ; off-sheet MCU_PHOTO_ADC_EOC
MCU_PHOTO_MISO: R129.1 ; off-sheet MCU_PHOTO_MISO
MCU_PHOTO_MOSI: R130.1 ; off-sheet MCU_PHOTO_MOSI
MCU_PHOTO_PD_CS: R131.1 ; off-sheet MCU_PHOTO_PD_CS
MCU_PHOTO_SCK: R128.1 ; off-sheet MCU_PHOTO_SCK
NTC1-: J7.2 ; off-sheet NTC1-
NTC2-: J7.4 ; off-sheet NTC2-
NTC3-: J7.6 ; off-sheet NTC3-
NTC4-: J7.8 ; off-sheet NTC4-
NTC5-: J7.10 ; off-sheet NTC5-
NTC6-: J7.12 ; off-sheet NTC6-
NTC7-: J7.14 ; off-sheet NTC7-
NTC8-: J7.16 ; off-sheet NTC8-
TEC_1_A: J5.1 ; off-sheet TEC_1_A
TEC_1_B: J5.2 ; off-sheet TEC_1_B
TEC_2_A: J5.3 ; off-sheet TEC_2_A
TEC_2_B: J5.4 ; off-sheet TEC_2_B
TEC_3_A: J5.5 ; off-sheet TEC_3_A
TEC_3_B: J5.6 ; off-sheet TEC_3_B
TEC_4_A: J5.7 ; off-sheet TEC_4_A
TEC_4_B: J5.8 ; off-sheet TEC_4_B
NetJ4_3: J4.3 R128.2
NetJ4_4: J4.4 R129.2
NetJ4_5: J4.5 R130.2
NetJ4_6: J4.6 R131.2
NetJ4_7: J4.7 R132.2
NetJ4_8: J4.8 R133.2
NetJ4_9: J4.9 R134.2
NetJ12_05: J12.05 R8.2
NetJ12_06: J12.06 R120.1
NetJ12_07: J12.07 R121.2
NetJ12_08: J12.08 R124.1
NetJ12_09: J12.09 R123.2
NetJ12_10: J12.10 R122.1
NetJ12_11: J12.11 R125.2
NetJ12_12: J12.12 R126.1
NetJ12_14: J12.14 R127.1

Not connected (* = marked no-connect by the designer): J12 13

### Layout directives
differential pair: CAM_CK_N, CAM_CK_P, CAM_D0_N, CAM_D0_P, CAM_D1_N, CAM_D1_P

### Notes on the sheet
- Project:
- Sub-system:
- Checked by:
- Design by:
- Sheet title:
- Doc no:
- Sheet
- Size
- Approved by:
- Revision:
- Date
- Text

### Library data of the parts
C152 C153 = CAP-CER
J2 = CON-PLG_4X1-50-RA-SMD: as J10 on sheet IR_LED; Case/Package: TH-CON; Supplier-1: WURTH; Supplier Part Number-1: 653104131822
J3 = 532611571: Conn Shrouded Header (4 Sides) HDR 15 POS 1.25mm Solder RA Side Entry SMD PicoBladeâ„¢ T/R; MF: Molex; SnapEDA_Link: https://www.snapeda.com/parts/532611571/Molex/view-part/?ref=snap; Package: None; Value: *; MP: 532611571; Check_prices: https://www.snapeda.com/parts/532611571/Molex/view-part/?ref=eda
R8 R120-R134 = RES-SMD
J1 = M80-5114242: Package: None; Price: None; Value: *; MP: M80-5114242; Availability: Unavailable
J4 = 532610971: Price: None; Value: *; Availability: Unavailable; Package: None; MP: 532610971
J5 J7 = M80-6661642: Package: None; Price: None; Value: *; MP: M80-6661642; Availability: Unavailable
J12 = ESQ-107-48-G-D: Value: *; Package: None; Price: None; MP: ESQ-107-48-G-D; Availability: Unavailable

## Nets that join several sheets
+3.3V: POWER (9 pins), MCU (21 pins), FRAM (C155.1 R139.2 R140.2 U22.8), I2C_SENSOR (14 pins), NTC (12 pins), TEC_DRV (14 pins), EXP_OBC_COMM (12 pins), HEADER (8 pins)
+5_TEC_HEATER: POWER (5 pins), HEATER (C83.1 C84.1 C122.1 C139.1), TEC_DRV (24 pins), HEADER (J5.10 J5.12 J5.14 J5.16)
+5V: POWER (16 pins), IR_LED (5 pins), EXP_OBC_COMM (8 pins), HEADER (J1.13)
+12V: POWER (8 pins), TEC_DRV (U9.23)
+12V_EXP: POWER (7 pins), HEADER (6 pins)
GND: POWER (43 pins), MCU (32 pins), FRAM (C156.2 U22.4), IR_LED (9 pins), I2C_SENSOR (10 pins), NTC (36 pins), HEATER (12 pins), TEC_DRV (68 pins), EXP_OBC_COMM (15 pins), HEADER (12 pins)
HEATER_1_B: HEATER (Q1.3), HEADER (J5.9)
HEATER_2_B: HEATER (Q2.3), HEADER (J5.11)
HEATER_3_B: HEATER (Q3.3), HEADER (J5.13)
HEATER_4_B: HEATER (Q4.3), HEADER (J5.15)
ISO_CANH: EXP_OBC_COMM (U11.7), HEADER (J1.18)
ISO_CANL: EXP_OBC_COMM (U11.6), HEADER (J1.39)
ISO_RS485_R+: EXP_OBC_COMM (R46.1 U12.14), HEADER (J1.37)
ISO_RS485_R-: EXP_OBC_COMM (R46.2 U12.13), HEADER (J1.36)
ISO_RS485_T+: EXP_OBC_COMM (R53.2 U12.11), HEADER (J1.16)
ISO_RS485_T-: EXP_OBC_COMM (R53.1 U12.12), HEADER (J1.15)
ISO_SCL: EXP_OBC_COMM (10.3 R42.1), HEADER (J1.17)
ISO_SDA: EXP_OBC_COMM (10.2 R43.1), HEADER (J1.38)
MCU_ADC_TEMP1: MCU (U20.15), NTC (C92.1 R66.1)
MCU_ADC_TEMP2: MCU (U20.16), NTC (C98.1 R72.2)
MCU_ADC_TEMP3: MCU (U20.17), NTC (C91.1 R67.2)
MCU_ADC_TEMP4: MCU (U20.18), NTC (C100.1 R73.1)
MCU_ADC_TEMP5: MCU (U20.33), NTC (C106.1 R78.2)
MCU_ADC_TEMP6: MCU (U20.34), NTC (C114.1 R84.1)
MCU_ADC_TEMP7: MCU (U20.35), NTC (C108.1 R80.1)
MCU_ADC_TEMP8: MCU (U20.36), NTC (C116.1 R85.2)
MCU_EF_5_AUX: POWER (R15.2), MCU (U20.84)
MCU_EF_5_EN: POWER (R13.2), MCU (U20.85)
MCU_EF_12_AUX: POWER (R4.2), MCU (U20.38)
MCU_EXP_CAN_RX: MCU (U20.70), EXP_OBC_COMM (R57.1)
MCU_EXP_CAN_TX: MCU (U20.71), EXP_OBC_COMM (R56.1)
MCU_EXP_RS485_DE: MCU (U20.51), EXP_OBC_COMM (R52.2)
MCU_EXP_RS485_~{RE}: MCU (U20.55), EXP_OBC_COMM (R51.2)
MCU_EXP_RS485_RX: MCU (U20.69), EXP_OBC_COMM (R50.2)
MCU_EXP_RS485_TX: MCU (U20.68), EXP_OBC_COMM (R54.2)
MCU_EXP_SCL: MCU (U20.47), EXP_OBC_COMM (R45.1)
MCU_EXP_SDA: MCU (U20.48), EXP_OBC_COMM (R44.1)
MCU_FRAM_~{CS}: MCU (U20.83), FRAM (R141.2)
MCU_HEATER_PWM1: MCU (U20.59), HEATER (R58.1)
MCU_HEATER_PWM2: MCU (U20.60), HEATER (R59.1)
MCU_HEATER_PWM3: MCU (U20.61), HEATER (R60.1)
MCU_HEATER_PWM4: MCU (U20.62), HEATER (R61.1)
MCU_IR_LED_PWM: MCU (U20.40), IR_LED (R103.2 R104.2)
MCU_IRQ_0: MCU (U20.67), HEADER (J1.35)
MCU_IRQ_1: MCU (U20.66), HEADER (J1.14)
MCU_LASER_ADC1: MCU (U20.25), HEADER (C153.1 R126.2)
MCU_LASER_ADC2: MCU (U20.26), HEADER (C152.1 R127.2)
MCU_LASER_DAC_CS: MCU (U20.43), HEADER (R123.1)
MCU_LASER_DAC_LATCH: MCU (U20.46), HEADER (R125.1)
MCU_LASER_MISO: MCU (U20.31), HEADER (R124.2)
MCU_LASER_MOSI: MCU (U20.32), HEADER (R122.2)
MCU_LASER_SCK: MCU (U20.30), HEADER (R120.2)
MCU_LASER_SW_EXT_CS: MCU (U20.44), HEADER (R121.1)
MCU_LASER_SW_INT_CS: MCU (U20.45), HEADER (R8.1)
MCU_PHOTO_ADC_CONV: MCU (U20.58), HEADER (R133.1)
MCU_PHOTO_ADC_CS: MCU (U20.57), HEADER (R132.1)
MCU_PHOTO_ADC_EOC: MCU (U20.65), HEADER (R134.1)
MCU_PHOTO_MISO: MCU (U20.53), HEADER (R129.1)
MCU_PHOTO_MOSI: MCU (U20.54), HEADER (R130.1)
MCU_PHOTO_PD_CS: MCU (U20.56), HEADER (R131.1)
MCU_PHOTO_SCK: MCU (U20.52), HEADER (R128.1)
MCU_SENSOR1_EN: MCU (U20.91), I2C_SENSOR (R96.1)
MCU_SENSOR2_EN: MCU (U20.90), I2C_SENSOR (R97.2)
MCU_SENSOR_SCL: MCU (U20.92), I2C_SENSOR (R94.1)
MCU_SENSOR_SDA: MCU (U20.93), I2C_SENSOR (R95.1)
MCU_TEC_1_~{CS}: MCU (U20.98), TEC_DRV (R145.1 U5.15)
MCU_TEC_1_EN: MCU (U20.5), TEC_DRV (R23.1)
MCU_TEC_1_SWEN: MCU (U20.4), TEC_DRV (R21.1)
MCU_TEC_2_~{CS}: MCU (U20.97), TEC_DRV (R146.1 U6.15)
MCU_TEC_2_EN: MCU (U20.7), TEC_DRV (R24.1)
MCU_TEC_2_SWEN: MCU (U20.3), TEC_DRV (R22.1)
MCU_TEC_3_~{CS}: MCU (U20.96), TEC_DRV (R147.1 U7.15)
MCU_TEC_3_EN: MCU (U20.8), TEC_DRV (R31.1)
MCU_TEC_3_SWEN: MCU (U20.1), TEC_DRV (R29.1)
MCU_TEC_4_~{CS}: MCU (U20.95), TEC_DRV (R148.1 U8.15)
MCU_TEC_4_EN: MCU (U20.9), TEC_DRV (R32.1)
MCU_TEC_4_SWEN: MCU (U20.2), TEC_DRV (R30.1)
MCU_TEC_ADC: MCU (U20.29), TEC_DRV (C70.1 R39.1)
MCU_TEC_ADC_CS: MCU (U20.86), TEC_DRV (U9.21)
MCU_TEC_MISO: MCU (U20.79), FRAM (R144.2), TEC_DRV (6 pins)
MCU_TEC_MOSI: MCU (U20.80), FRAM (R143.2), TEC_DRV (5 pins)
MCU_TEC_SCK: MCU (U20.78), FRAM (R142.2), TEC_DRV (5 pins)
NTC1-: NTC (R68.1 R71.2), HEADER (J7.2)
NTC2-: NTC (R74.2 R77.1), HEADER (J7.4)
NTC3-: NTC (R69.2 R70.1), HEADER (J7.6)
NTC4-: NTC (R75.1 R76.2), HEADER (J7.8)
NTC5-: NTC (R79.2 R82.1), HEADER (J7.10)
NTC6-: NTC (R86.1 R88.2), HEADER (J7.12)
NTC7-: NTC (R81.1 R83.2), HEADER (J7.14)
NTC8-: NTC (R87.2 R89.1), HEADER (J7.16)
TEC_1_A: TEC_DRV (5 pins), HEADER (J5.1)
TEC_1_B: TEC_DRV (C35.1 C42.2 L2.2 U5.12), HEADER (J5.2)
TEC_2_A: TEC_DRV (5 pins), HEADER (J5.3)
TEC_2_B: TEC_DRV (C34.1 C43.2 L3.2 U6.12), HEADER (J5.4)
TEC_3_A: TEC_DRV (5 pins), HEADER (J5.5)
TEC_3_B: TEC_DRV (C58.1 C66.2 L4.2 U7.12), HEADER (J5.6)
TEC_4_A: TEC_DRV (5 pins), HEADER (J5.7)
TEC_4_B: TEC_DRV (C59.1 C67.2 L5.2 U8.12), HEADER (J5.8)